# EAGLE design Fathom-Serial (EAGLE 7.4.0)

## Sheet 1 of 7
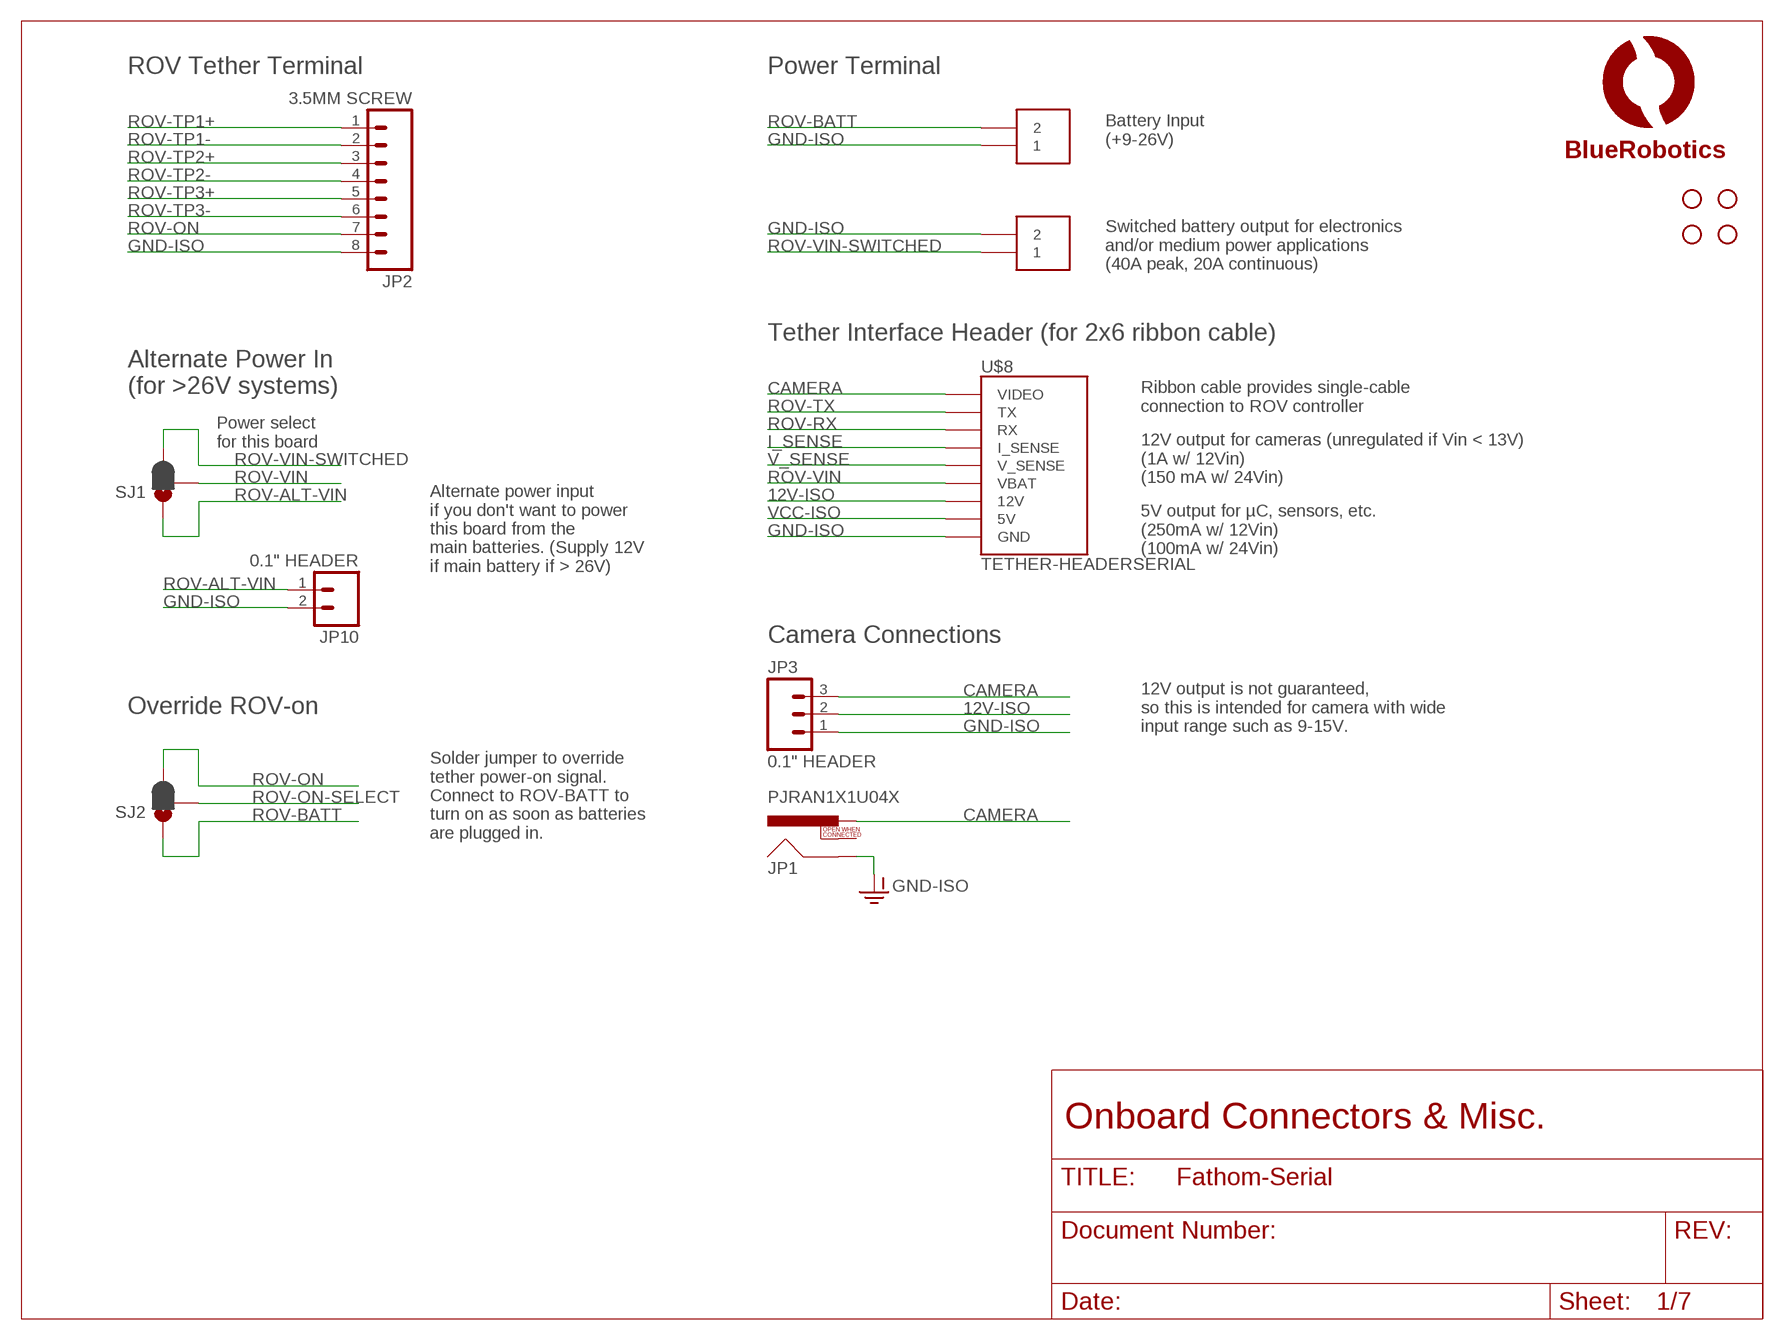
[diagram p0: schematic, sheet 1]

### Parts
JP1  PJRAN1X1U04X  RCA  [RCA]
JP2  3.5MM SCREW  M083.5MM-8  [SCREWTERMINAL-3.5MM-8]
JP3  0.1" HEADER  M03PTH  [1X03]
JP10  0.1" HEADER  M02PTH  [1X02]
SJ1  JUMPER-PAD-3-2OF3_NC_BY_PASTE  [PAD-JUMPER-3-2OF3_NC_BY_PASTE_YES_SILK_FULL_BOX]
SJ2  JUMPER-PAD-3-2OF3_NC_BY_PASTE  [PAD-JUMPER-3-2OF3_NC_BY_PASTE_YES_SILK_FULL_BOX]
STANDOFF1  STAND-OFF  [STAND-OFF]
STANDOFF2  STAND-OFF  [STAND-OFF]
STANDOFF3  STAND-OFF  [STAND-OFF]
STANDOFF4  STAND-OFF  [STAND-OFF]
U$4  LOGOFULL-M  [BR-FULL-LOGO-MEDIUM]
U$8  TETHER-HEADERSERIAL  [TETHER-HEADER-2X7]
U$10  HEADER-2  [TETHER-POWER-TERMINALS]
U$11  HEADER-2  [TETHER-POWER-TERMINALS]

### Nets
12V-ISO: JP3.2 U$8.12V ; also sheet 4
CAMERA: JP1.PIN JP3.3 U$8.VIDEO ; also sheet 6
GND-ISO: JP1.SHELL JP2.8 JP3.1 JP10.2 U$8.GND0(GND) U$8.GND1(GND) U$8.GND2(GND) U$10.1A U$10.1B U$11.2A U$11.2B ; also sheet 3,4,5,6,7
I_SENSE: U$8.I_SENSE ; also sheet 5
ROV-ALT-VIN: JP10.1 SJ1.1
ROV-BATT: SJ2.1 U$10.2A U$10.2B ; also sheet 5
ROV-ON: JP2.7 SJ2.3
ROV-ON-SELECT: SJ2.2 ; also sheet 5
ROV-RX: U$8.RX ; also sheet 7
ROV-TP1+: JP2.1 ; also sheet 6
ROV-TP1-: JP2.2 ; also sheet 6
ROV-TP2+: JP2.3 ; also sheet 7
ROV-TP2-: JP2.4 ; also sheet 7
ROV-TP3+: JP2.5 ; also sheet 7
ROV-TP3-: JP2.6 ; also sheet 7
ROV-TX: U$8.TX ; also sheet 7
ROV-VIN: SJ1.2 U$8.VBAT ; also sheet 4
ROV-VIN-SWITCHED: SJ1.3 U$11.1A U$11.1B ; also sheet 5
V_SENSE: U$8.V_SENSE ; also sheet 5
VCC-ISO: U$8.5V ; also sheet 3,4,5,6,7
Unconnected: JP1.SWITCH

### Notes on the sheet
- ROV Tether Terminal | Power Terminal
- Battery Input
  (+9-26V)
- Switched battery output for electronics 
  and/or medium power applications
  (40A peak, 20A continuous)
- Tether Interface Header (for 2x6 ribbon cable)
- Alternate Power In
  (for >26V systems)
- Ribbon cable provides single-cable 
  connection to ROV controller
- Power select 
  for this board
- 12V output for cameras (unregulated if Vin < 13V)
  (1A w/ 12Vin)
  (150 mA w/ 24Vin)
- 5V output for µC, sensors, etc.
  (250mA w/ 12Vin)
  (100mA w/ 24Vin)
- Alternate power input
  if you don't want to power
  this board from the 
  main batteries. (Supply 12V
  if main battery if > 26V)
- Camera Connections
- Override ROV-on
- 12V output is not guaranteed, 
  so this is intended for camera with wide 
  input range such as 9-15V.
- Solder jumper to override
  tether power-on signal. 
  Connect to ROV-BATT to 
  turn on as soon as batteries
  are plugged in.
- Onboard Connectors & Misc.

## Sheet 2 of 7
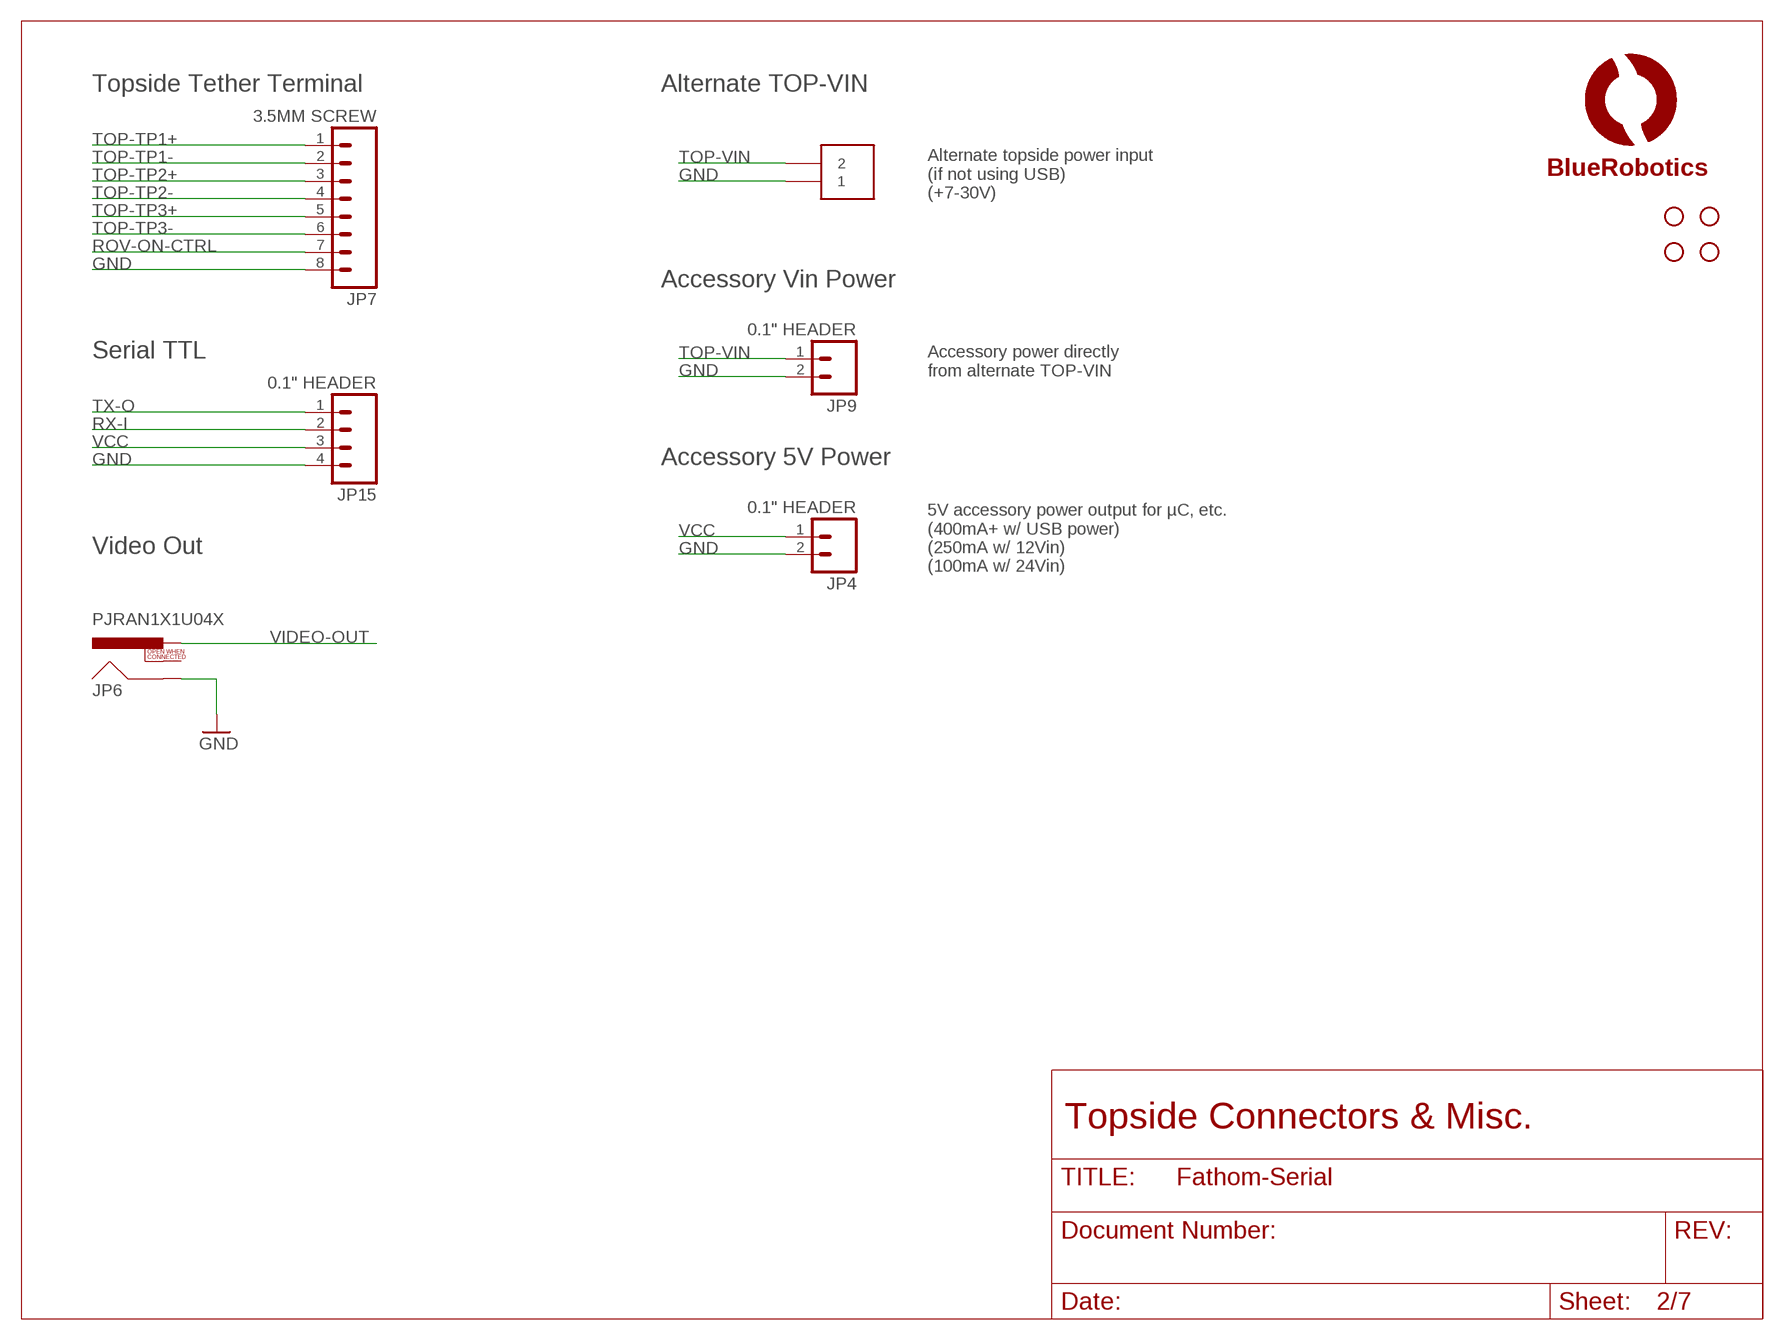
[diagram p1: schematic, sheet 2]

### Parts
JP4  0.1" HEADER  M02PTH  [1X02]
JP6  PJRAN1X1U04X  RCA  [RCA]
JP7  3.5MM SCREW  M083.5MM-8  [SCREWTERMINAL-3.5MM-8]
JP9  0.1" HEADER  M02PTH  [1X02]
JP15  0.1" HEADER  M04PTH  [1X04]
STANDOFF5  STAND-OFF  [STAND-OFF]
STANDOFF6  STAND-OFF  [STAND-OFF]
STANDOFF7  STAND-OFF  [STAND-OFF]
STANDOFF8  STAND-OFF  [STAND-OFF]
U$5  LOGOBR-LOGO-MS  [BR-LOGO-MEDIUM-SMALL]
U$12  HEADER-2  [TETHER-POWER-TERMINALS]

### Nets
GND: JP4.2 JP6.SHELL JP7.8 JP9.2 JP15.4 U$12.1A U$12.1B ; also sheet 3,4,6,7
ROV-ON-CTRL: JP7.7 ; also sheet 7
RX-I: JP15.2 ; also sheet 7
TOP-TP1+: JP7.1 ; also sheet 6
TOP-TP1-: JP7.2 ; also sheet 6
TOP-TP2+: JP7.3 ; also sheet 7
TOP-TP2-: JP7.4 ; also sheet 7
TOP-TP3+: JP7.5 ; also sheet 7
TOP-TP3-: JP7.6 ; also sheet 7
TOP-VIN: JP9.1 U$12.2A U$12.2B ; also sheet 4
TX-O: JP15.1 ; also sheet 7
VCC: JP4.1 JP15.3 ; also sheet 3,4,6,7
VIDEO-OUT: JP6.PIN ; also sheet 6
Unconnected: JP6.SWITCH

### Notes on the sheet
- Topside Tether Terminal | Alternate TOP-VIN
- Alternate topside power input 
  (if not using USB)
  (+7-30V)
- Accessory Vin Power
- Serial TTL
- Accessory power directly 
  from alternate TOP-VIN
- Accessory 5V Power
- Video Out
- 5V accessory power output for µC, etc.
  (400mA+ w/ USB power)
  (250mA w/ 12Vin)
  (100mA w/ 24Vin)
- Topside Connectors & Misc.

## Sheet 3 of 7
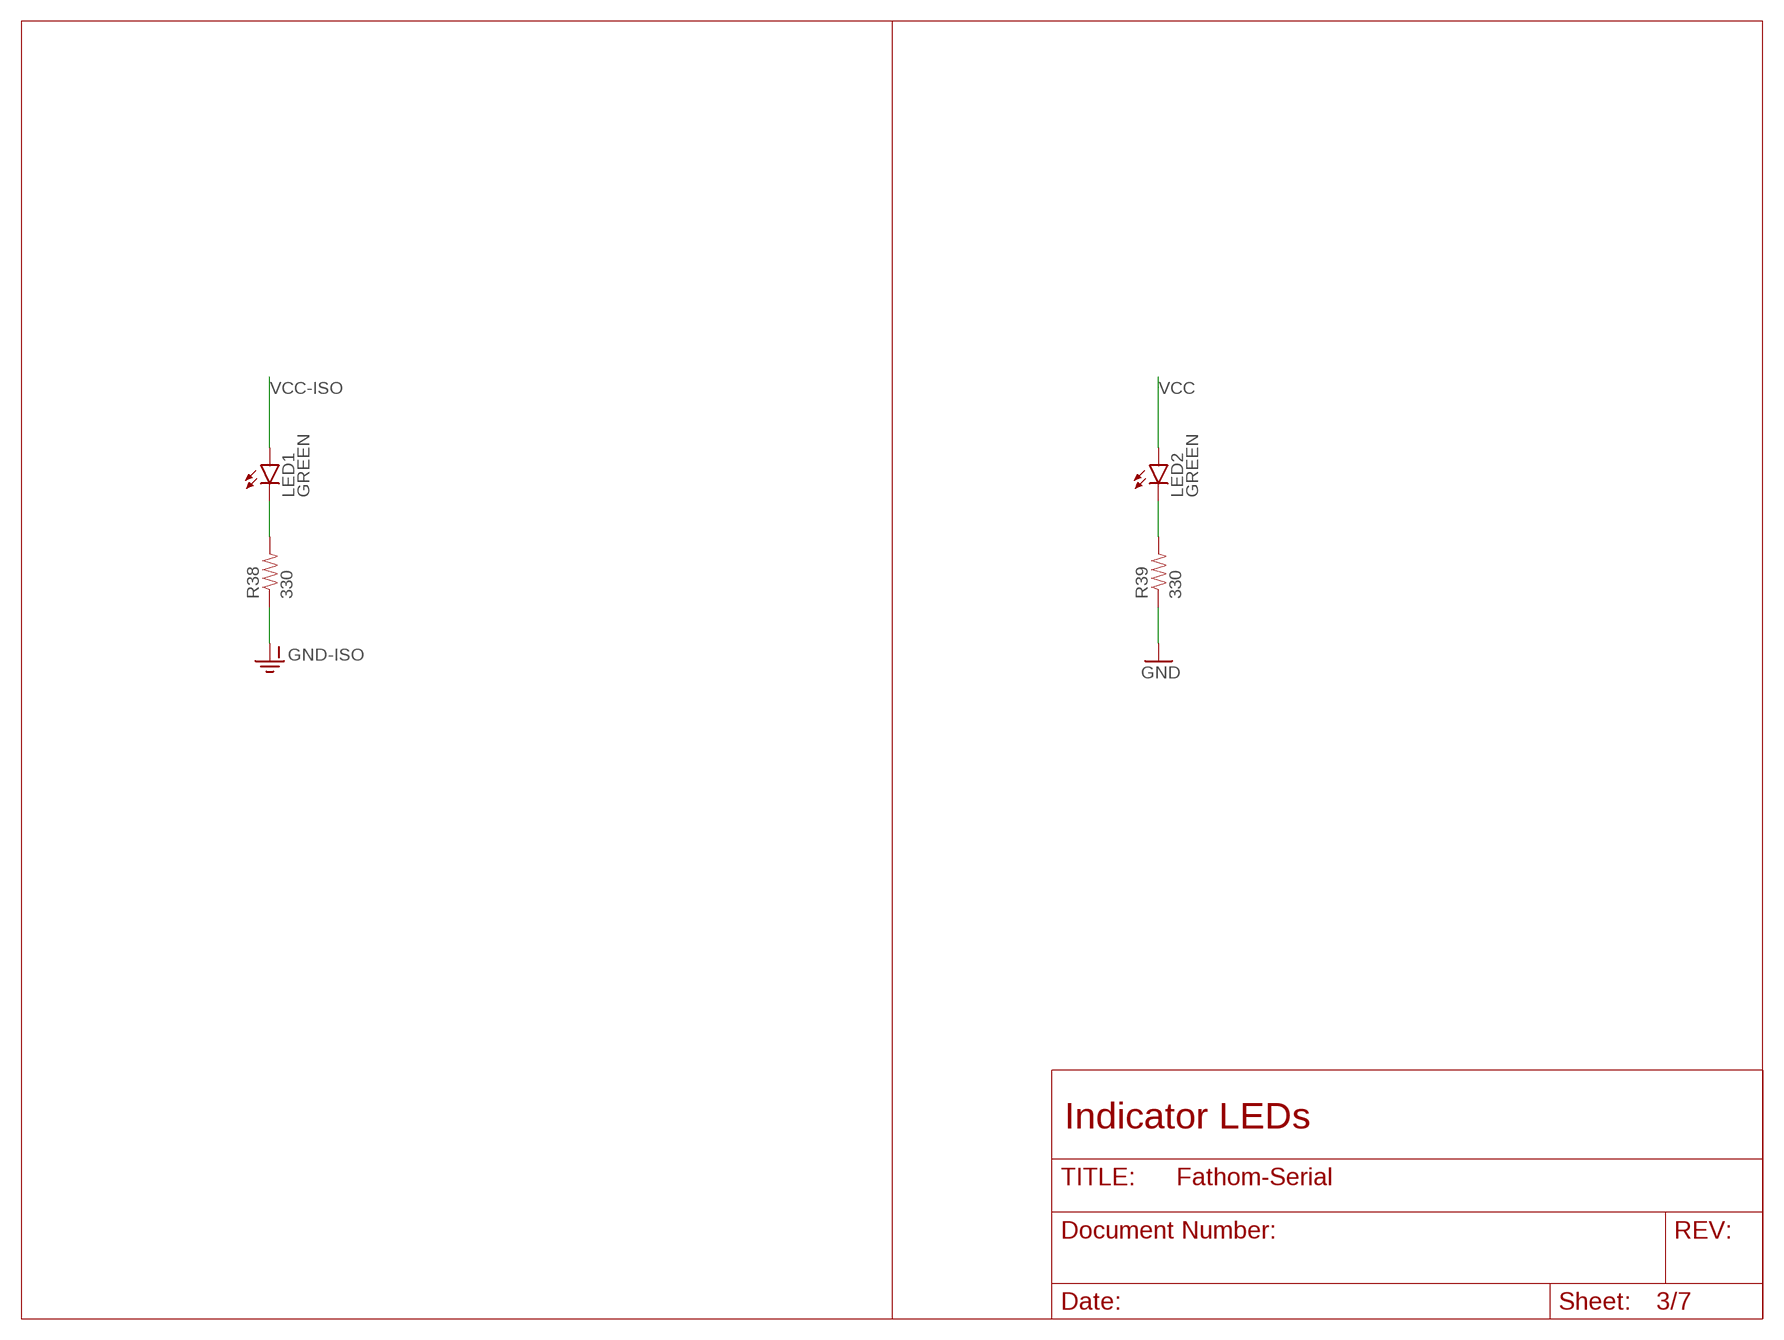
[diagram p2: schematic, sheet 3]

### Parts
LED1  GREEN  LED0603  [LED-0603]
LED2  GREEN  LED0603  [LED-0603]
R38  330  33KOHM1/10W1%(0603)  [0603-RES]
R39  330  33KOHM1/10W1%(0603)  [0603-RES]

### Nets
GND: R39.1 ; also sheet 2,4,6,7
GND-ISO: R38.1 ; also sheet 1,4,5,6,7
N$31: LED1.C R38.2
N$32: LED2.C R39.2
VCC: LED2.A ; also sheet 2,4,6,7
VCC-ISO: LED1.A ; also sheet 1,4,5,6,7

### Notes on the sheet
- Indicator LEDs

## Sheet 4 of 7
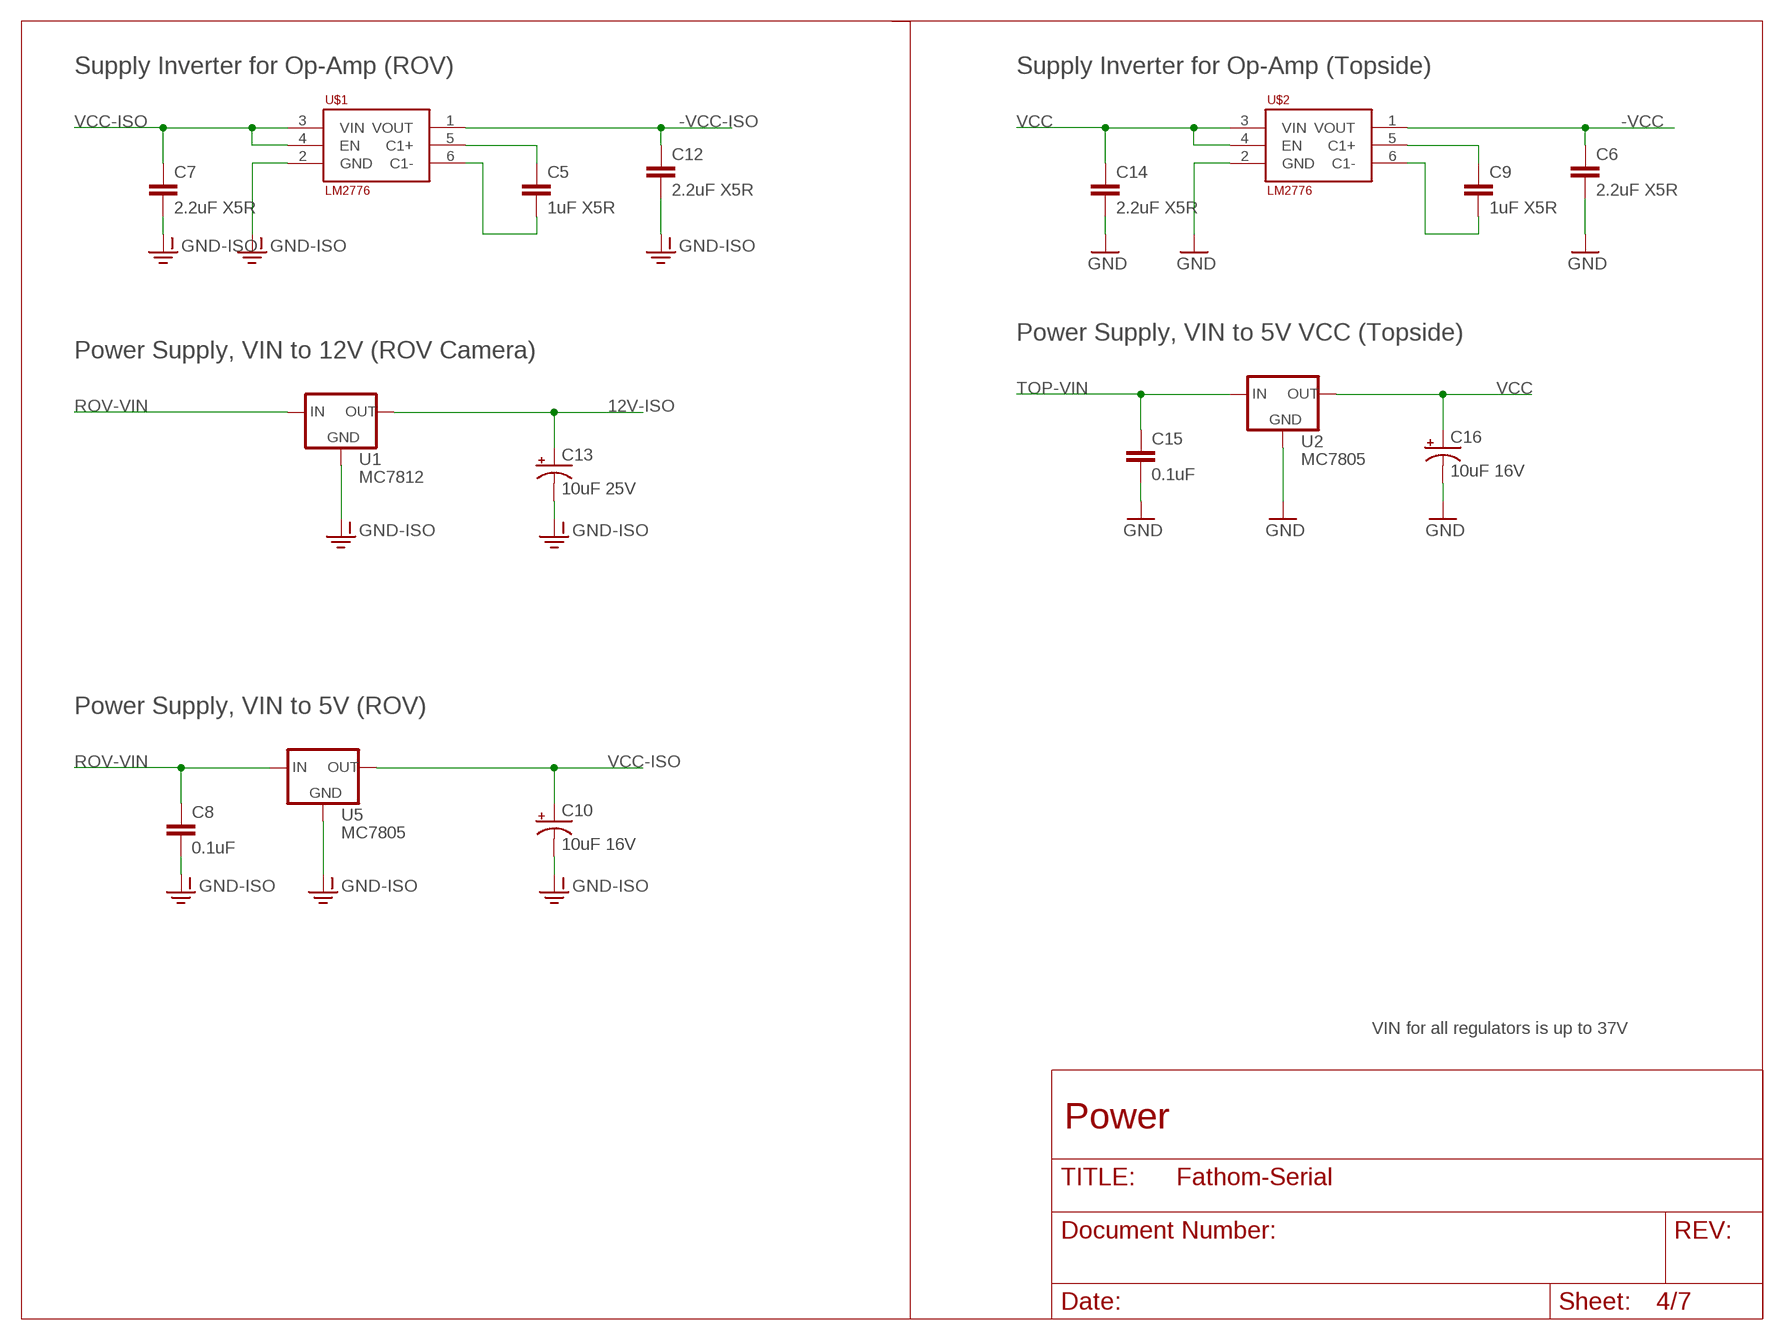
[diagram p3: schematic, sheet 4]

### Parts
C5  1uF X5R  CAP0603-CAP  [0603-CAP]
C6  2.2uF X5R  CAP0603-CAP  [0603-CAP]
C7  2.2uF X5R  CAP0603-CAP  [0603-CAP]
C8  0.1uF  CAP0603-CAP  [0603-CAP]
C9  1uF X5R  CAP0603-CAP  [0603-CAP]
C10  10uF 16V  CAP_POL1206  [EIA3216]
C12  2.2uF X5R  CAP0603-CAP  [0603-CAP]
C13  10uF 25V  CAP_POL6032  [EIA6032]
C14  2.2uF X5R  CAP0603-CAP  [0603-CAP]
C15  0.1uF  CAP0603-CAP  [0603-CAP]
C16  10uF 16V  CAP_POL1206  [EIA3216]
U1  MC7812  78XX  [DPAK]
U2  MC7805  78XX  [DPAK]
U5  MC7805  78XX  [DPAK]
U$1  LM2776  [SOT-23-6]
U$2  LM2776  [SOT-23-6]

### Nets
12V-ISO: C13.P$1(+) U1.3(OUT) ; also sheet 1
-VCC: C6.1 U$2.1(VOUT) ; also sheet 6
-VCC-ISO: C12.1 U$1.1(VOUT) ; also sheet 6
GND: C6.2 C14.2 C15.2 C16.C(-) U2.4(GND) U$2.2(GND) ; also sheet 2,3,6,7
GND-ISO: C7.2 C8.2 C10.C(-) C12.2 C13.P$2(-) U1.4(GND) U5.4(GND) U$1.2(GND) ; also sheet 1,3,5,6,7
N$3: C9.1 U$2.5(C1+)
N$4: C9.2 U$2.6(C1-)
N$10: C5.1 U$1.5(C1+)
N$11: C5.2 U$1.6(C1-)
ROV-VIN: C8.1 U1.1(IN) U5.1(IN) ; also sheet 1
TOP-VIN: C15.1 U2.1(IN) ; also sheet 2
VCC: C14.1 C16.A(+) U2.3(OUT) U$2.3(VIN) U$2.4(EN) ; also sheet 2,3,6,7
VCC-ISO: C7.1 C10.A(+) U5.3(OUT) U$1.3(VIN) U$1.4(EN) ; also sheet 1,3,5,6,7

### Notes on the sheet
- Supply Inverter for Op-Amp (ROV) | Supply Inverter for Op-Amp (Topside)
- Power Supply, VIN to 5V VCC (Topside)
- Power Supply, VIN to 12V (ROV Camera)
- Power Supply, VIN to 5V (ROV)
- VIN for all regulators is up to 37V
- Power

## Sheet 5 of 7
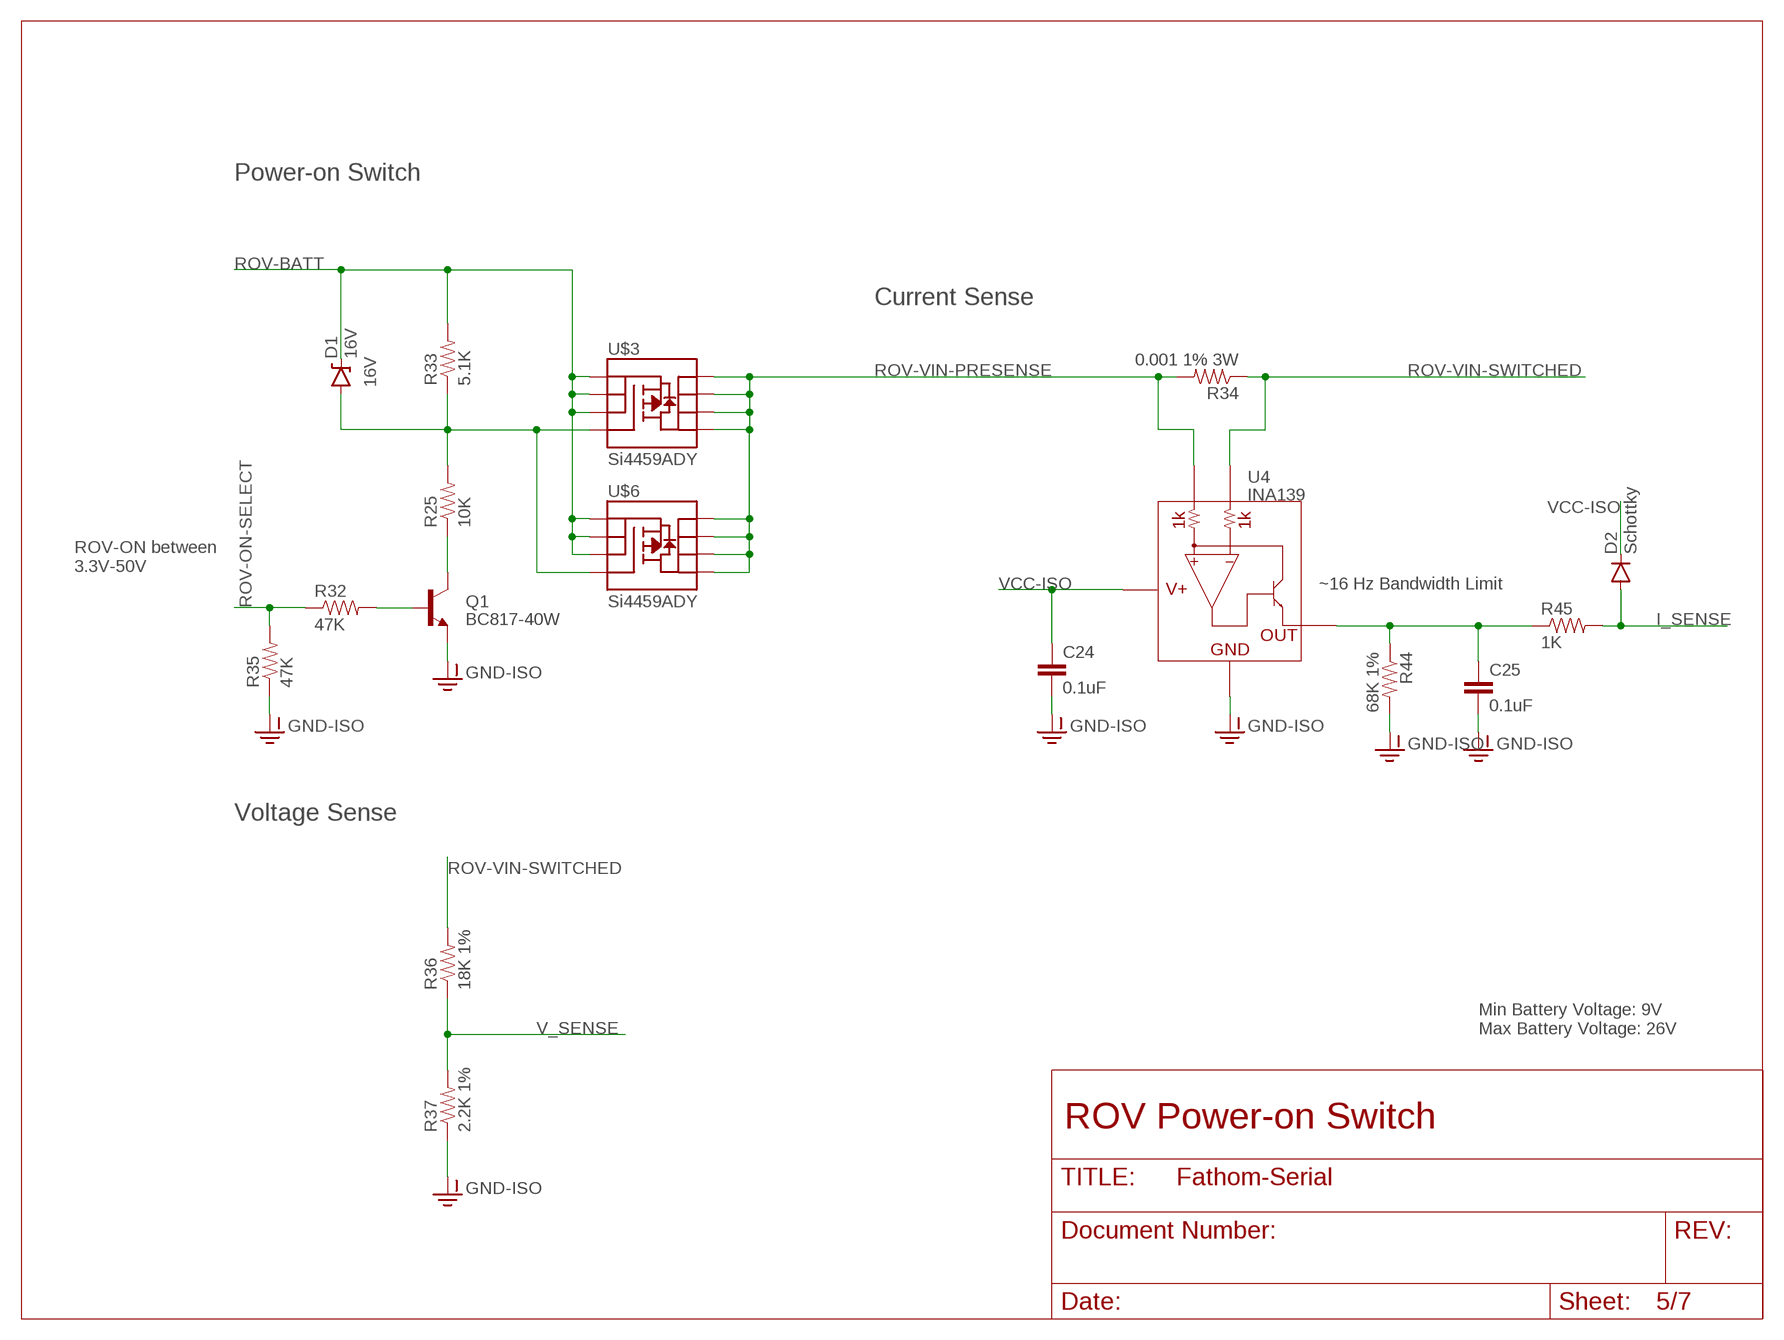
[diagram p4: schematic, sheet 5]

### Parts
C24  0.1uF  CAP0603-CAP  [0603-CAP]
C25  0.1uF  CAP0603-CAP  [0603-CAP]
D1  16V  DIODE-ZENER3.3V  [SOD-323]
D2  Schottky  DIODESOD  [SOD-323]
Q1  BC817-40W  TRANSISTOR_NPNSOT23  [SOT23]
R25  10K  33KOHM1/10W1%(0603)  [0603-RES]
R32  47K  33KOHM1/10W1%(0603)  [0603-RES]
R33  5.1K  33KOHM1/10W1%(0603)  [0603-RES]
R34  0.001 1% 3W  RESISTOR2512  [R2512]
R35  47K  33KOHM1/10W1%(0603)  [0603-RES]
R36  18K 1%  33KOHM1/10W1%(0603)  [0603-RES]
R37  2.2K 1%  33KOHM1/10W1%(0603)  [0603-RES]
R44  68K 1%  33KOHM1/10W1%(0603)  [0603-RES]
R45  1K  33KOHM1/10W1%(0603)  [0603-RES]
U4  INA139  [SOT23-5]
U$3  Si4459ADY  MOSFET-PCHANNEL-SOIC8SOIC8  [SO08]
U$6  Si4459ADY  MOSFET-PCHANNEL-SOIC8SOIC8  [SO08]

### Nets
GND-ISO: C24.2 C25.2 Q1.2(E) R35.1 R37.1 R44.2 U4.2(GND) ; also sheet 1,3,4,6,7
I_SENSE: D2.A R45.2 ; also sheet 1
N$27: Q1.1(B) R32.2
N$28: D1.A R25.2 R33.1 U$3.4(G) U$6.4(G)
N$30: Q1.3(C) R25.1
N$33: C25.1 R44.1 R45.1 U4.1(OUT)
ROV-BATT: D1.C R33.2 U$3.1(S) U$3.2(S) U$3.3(S) U$6.1(S) U$6.2(S) U$6.3(S) ; also sheet 1
ROV-ON-SELECT: R32.1 R35.2 ; also sheet 1
ROV-VIN-PRESENSE: R34.2 U4.3(VIN+) U$3.5(D) U$3.6(D) U$3.7(D) U$3.8(D) U$6.5(D) U$6.6(D) U$6.7(D) U$6.8(D)
ROV-VIN-SWITCHED: R34.1 R36.2 U4.4(VIN-) ; also sheet 1
V_SENSE: R36.1 R37.2 ; also sheet 1
VCC-ISO: C24.1 D2.C U4.5(V+) ; also sheet 1,3,4,6,7

### Notes on the sheet
- Power-on Switch
- Current Sense
- 16V
- ROV-ON between
  3.3V-50V
- ~16 Hz Bandwidth Limit
- Voltage Sense
- Min Battery Voltage: 9V
  Max Battery Voltage: 26V
- ROV Power-on Switch

## Sheet 6 of 7
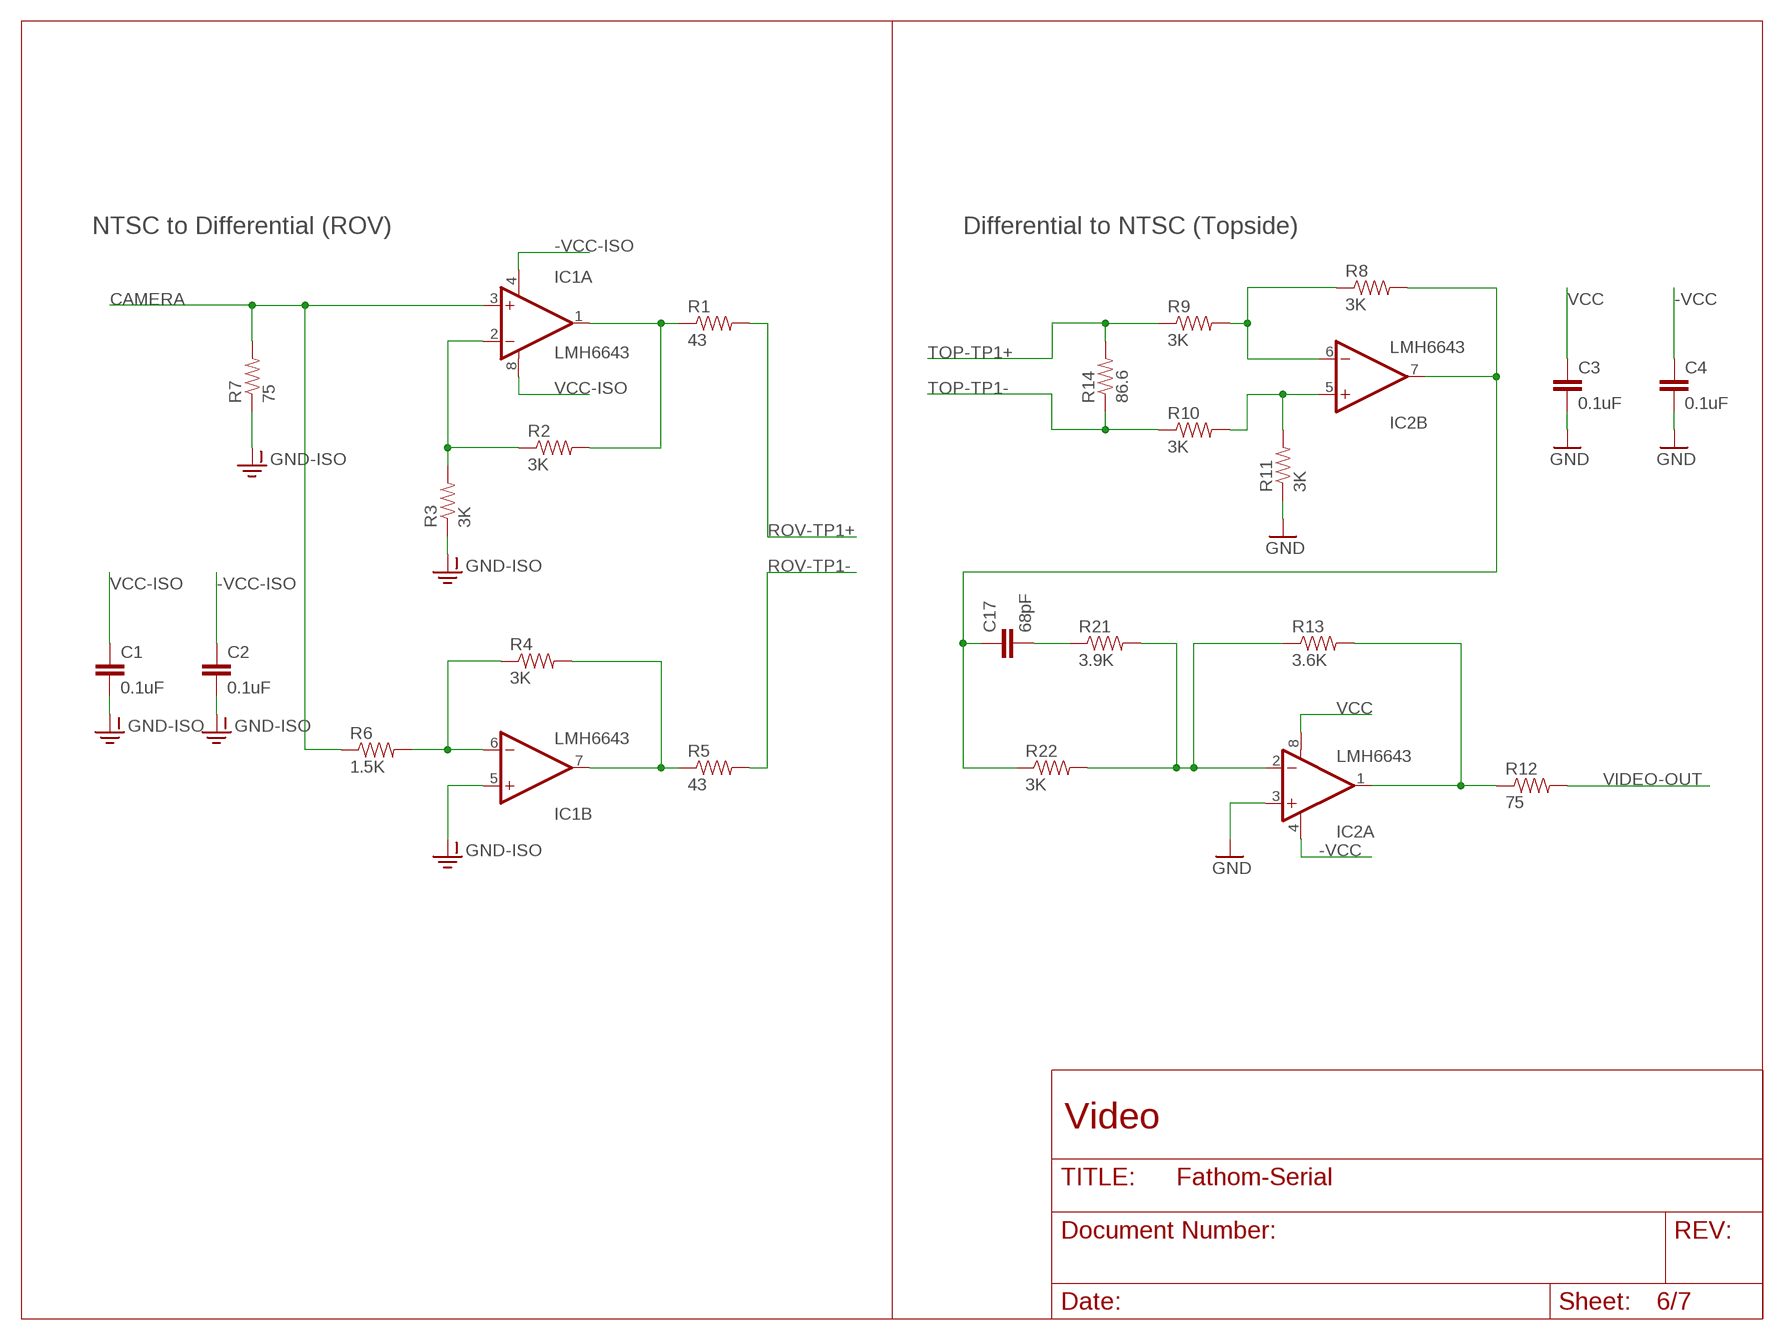
[diagram p5: schematic, sheet 6]

### Parts
C1  0.1uF  CAP0603-CAP  [0603-CAP]
C2  0.1uF  CAP0603-CAP  [0603-CAP]
C3  0.1uF  CAP0603-CAP  [0603-CAP]
C4  0.1uF  CAP0603-CAP  [0603-CAP]
C17  68pF  CAP0603-CAP  [0603-CAP]
IC1  LMH6643  OPAMP-DUALU  [SO08]
IC2  LMH6643  OPAMP-DUALU  [SO08]
R1  43  RESISTOR0603-RES  [0603-RES]
R2  3K  RESISTOR0603-RES  [0603-RES]
R3  3K  RESISTOR0603-RES  [0603-RES]
R4  3K  RESISTOR0603-RES  [0603-RES]
R5  43  RESISTOR0603-RES  [0603-RES]
R6  1.5K  RESISTOR0603-RES  [0603-RES]
R7  75  RESISTOR0603-RES  [0603-RES]
R8  3K  RESISTOR0603-RES  [0603-RES]
R9  3K  RESISTOR0603-RES  [0603-RES]
R10  3K  RESISTOR0603-RES  [0603-RES]
R11  3K  RESISTOR0603-RES  [0603-RES]
R12  75  RESISTOR0603-RES  [0603-RES]
R13  3.6K  RESISTOR0603-RES  [0603-RES]
R14  86.6  RESISTOR0603-RES  [0603-RES]
R21  3.9K  RESISTOR0603-RES  [0603-RES]
R22  3K  RESISTOR0603-RES  [0603-RES]

### Nets
-VCC: C4.1 IC2.4(A:V-) ; also sheet 4
-VCC-ISO: C2.1 IC1.4(A:V-) ; also sheet 4
CAMERA: IC1.3(A:+IN) R6.1 R7.2 ; also sheet 1
GND: C3.2 C4.2 IC2.3(A:+IN) R11.1 ; also sheet 2,3,4,7
GND-ISO: C1.2 C2.2 IC1.5(B:+IN) R3.1 R7.1 ; also sheet 1,3,4,5,7
N$1: IC1.1(A:OUT) R1.1 R2.2
N$2: IC1.7(B:OUT) R4.2 R5.1
N$5: IC1.2(A:-IN) R2.1 R3.2
N$6: IC1.6(B:-IN) R4.1 R6.2
N$8: IC2.5(B:+IN) R10.2 R11.2
N$9: IC2.6(B:-IN) R8.1 R9.2
N$14: C17.1 IC2.7(B:OUT) R8.2 R22.1
N$15: IC2.2(A:-IN) R13.1 R21.2 R22.2
N$16: C17.2 R21.1
N$17: IC2.1(A:OUT) R12.1 R13.2
ROV-TP1+: R1.2 ; also sheet 1
ROV-TP1-: R5.2 ; also sheet 1
TOP-TP1+: R9.1 R14.2 ; also sheet 2
TOP-TP1-: R10.1 R14.1 ; also sheet 2
VCC: C3.1 IC2.8(A:V+) ; also sheet 2,3,4,7
VCC-ISO: C1.1 IC1.8(A:V+) ; also sheet 1,3,4,5,7
VIDEO-OUT: R12.2 ; also sheet 2

### Notes on the sheet
- NTSC to Differential (ROV) | Differential to NTSC (Topside)
- Video

## Sheet 7 of 7
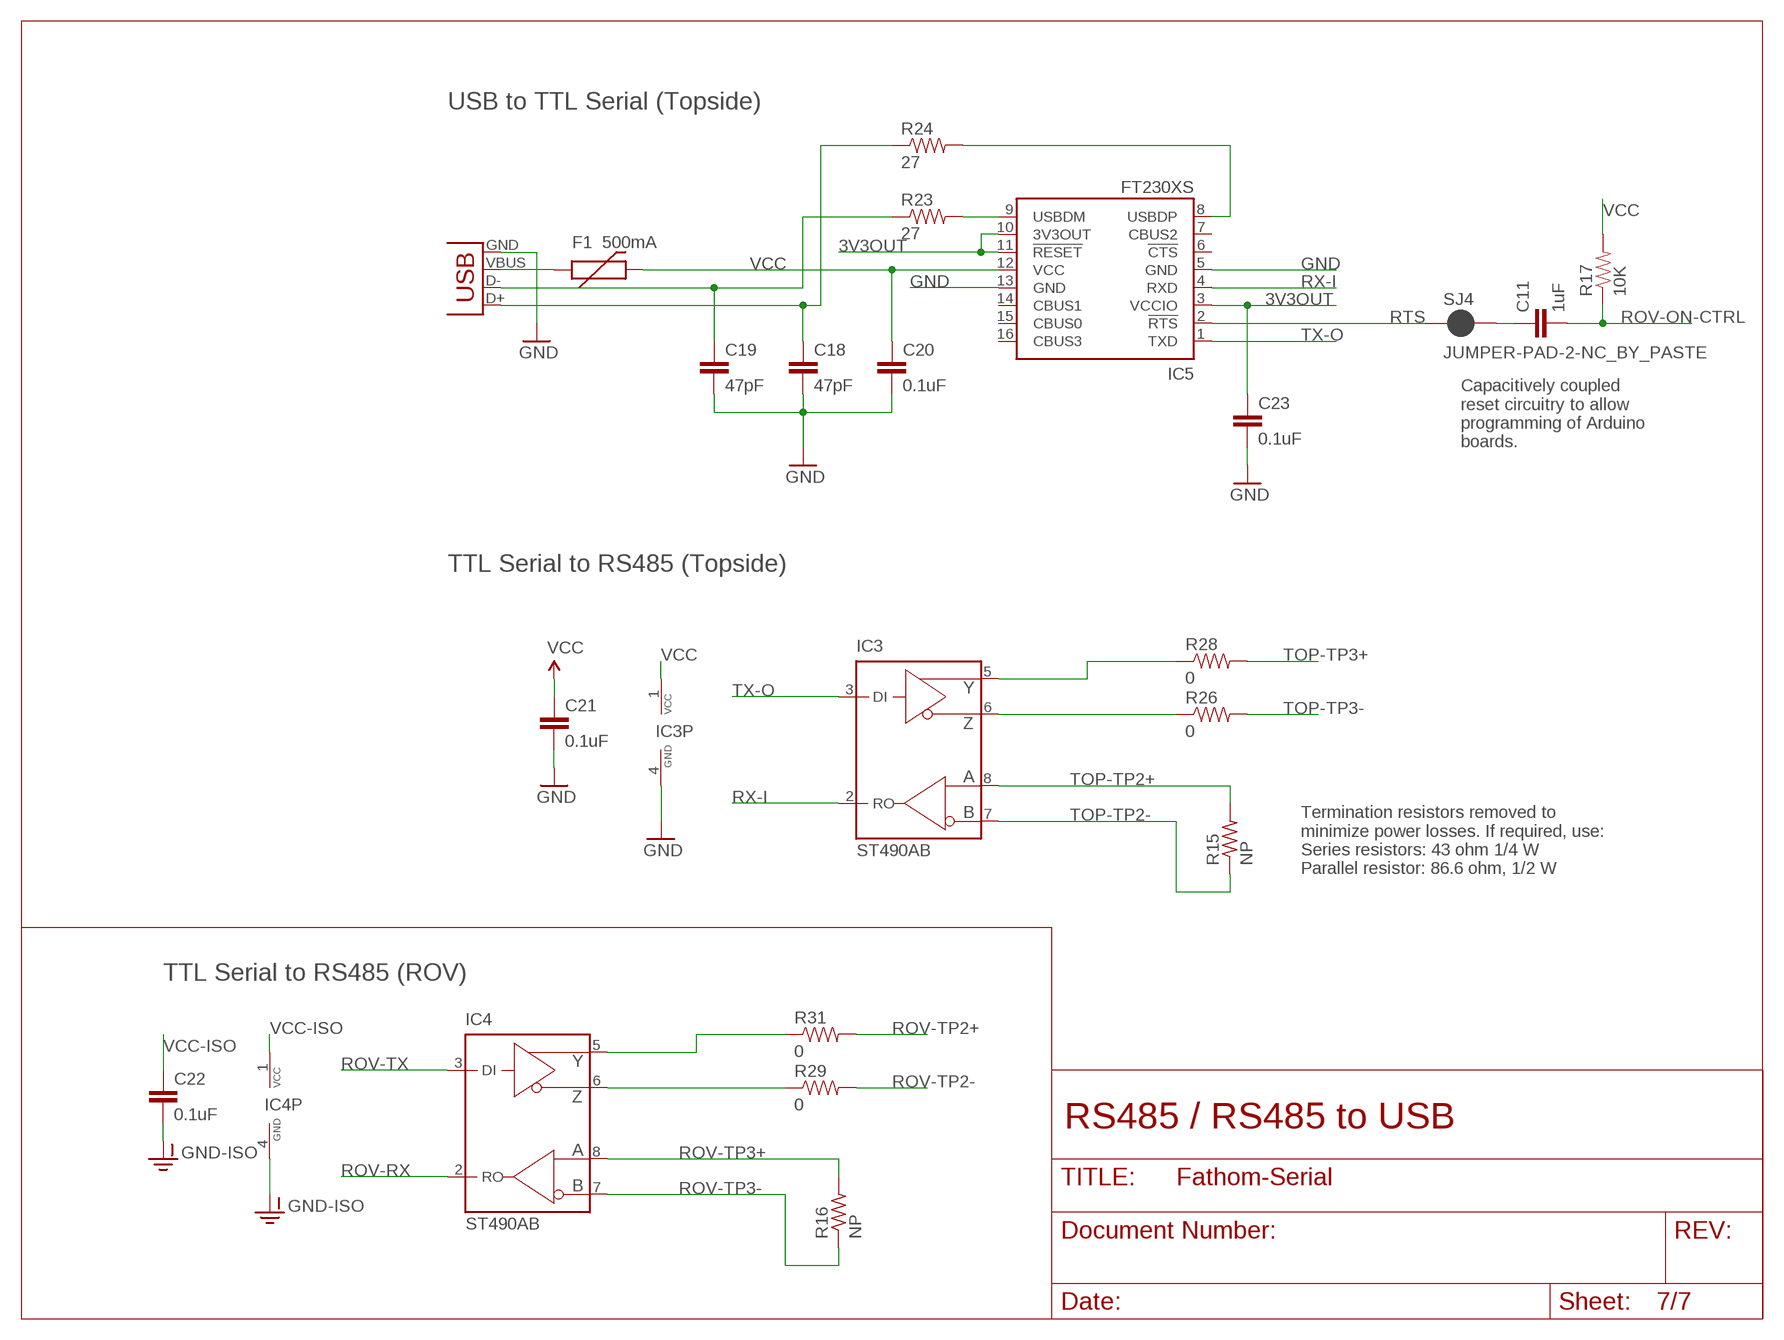
[diagram p6: schematic, sheet 7]

### Parts
C11  1uF  CAP0603-CAP  [0603-CAP]
C18  47pF  CAP0603-CAP  [0603-CAP]
C19  47pF  CAP0603-CAP  [0603-CAP]
C20  0.1uF  CAP0603-CAP  [0603-CAP]
C21  0.1uF  CAP0603-CAP  [0603-CAP]
C22  0.1uF  CAP0603-CAP  [0603-CAP]
C23  0.1uF  CAP0603-CAP  [0603-CAP]
F1  500mA  PTC0603  [0603]
IC3  ST490AB  MAX488CSA  [SO08]
IC4  ST490AB  MAX488CSA  [SO08]
IC5  FT230XS  [SSOP16]
R15  NP  R-US_R1210  [R1210]
R16  NP  R-US_R1210  [R1210]
R17  10K  RESISTOR0603-RES  [0603-RES]
R23  27  RESISTOR0603-RES  [0603-RES]
R24  27  RESISTOR0603-RES  [0603-RES]
R26  0  RESISTOR1206  [1206]
R28  0  RESISTOR1206  [1206]
R29  0  RESISTOR1206  [1206]
R31  0  RESISTOR1206  [1206]
SJ4  JUMPER-PAD-2-NC_BY_PASTE  [PAD-JUMPER-2-NC_BY_PASTE_YES_SILK]
X2  USBSMD  [USB-MINIB]

### Nets
3V3OUT: C23.1 IC5.3(VCCIO) IC5.10(3V3OUT) IC5.11(!RESET)
GND: C18.2 C19.2 C20.2 C21.2 C23.2 IC3.4(GND) IC5.5(GND) IC5.13(GND) X2.GND ; also sheet 2,3,4,6
GND-ISO: C22.2 IC4.4(GND) ; also sheet 1,3,4,5,6
N$7: C11.1 SJ4.2
N$19: C19.1 R23.1 X2.D-
N$20: C18.1 R24.1 X2.D+
N$21: F1.1 X2.VBUS
N$22: IC5.8(USBDP) R24.2
N$23: IC3.5(Y) R28.1
N$24: IC4.5(Y) R31.1
N$25: IC4.6(Z) R29.1
N$26: IC3.6(Z) R26.1
N$29: IC5.9(USBDM) R23.2
ROV-ON-CTRL: C11.2 R17.1 ; also sheet 2
ROV-RX: IC4.2(RO) ; also sheet 1
ROV-TP2+: R31.2 ; also sheet 1
ROV-TP2-: R29.2 ; also sheet 1
ROV-TP3+: IC4.8(A) R16.2 ; also sheet 1
ROV-TP3-: IC4.7(B) R16.1 ; also sheet 1
ROV-TX: IC4.3(DI) ; also sheet 1
RTS: IC5.2(!RTS) SJ4.1
RX-I: IC3.2(RO) IC5.4(RXD) ; also sheet 2
TOP-TP2+: IC3.8(A) R15.2 ; also sheet 2
TOP-TP2-: IC3.7(B) R15.1 ; also sheet 2
TOP-TP3+: R28.2 ; also sheet 2
TOP-TP3-: R26.2 ; also sheet 2
TX-O: IC3.3(DI) IC5.1(TXD) ; also sheet 2
VCC: C20.1 C21.1 F1.2 IC3.1(VCC) IC5.12(VCC) R17.2 ; also sheet 2,3,4,6
VCC-ISO: C22.1 IC4.1(VCC) ; also sheet 1,3,4,5,6
Unconnected: IC5.6(!CTS) IC5.7(CBUS2) IC5.14(CBUS1) IC5.15(CBUS0) IC5.16(CBUS3)

### Notes on the sheet
- USB to TTL Serial (Topside)
- Capacitively coupled
  reset circuitry to allow
  programming of Arduino
  boards.
- TTL Serial to RS485 (Topside)
- Termination resistors removed to 
  minimize power losses. If required, use:
  Series resistors: 43 ohm 1/4 W
  Parallel resistor: 86.6 ohm, 1/2 W
- TTL Serial to RS485 (ROV)
- RS485 / RS485 to USB

## Library data of the parts
C1-C9 C12 C14 C15 C17 C24 C25 = SparkFun-Passives:CAP: Capacitor Standard 0603 ceramic capacitor, and 0.1" leaded capacitor.
C10 C13 C16 = SparkFun-Passives:CAP_POL: Capacitor Polarized These are standard SMD and PTH capacitors. Normally 10uF, 47uF, and 100uF in electrolytic and tantalum varieties. Always verify the external diameter of the through hole cap, it varies with capacity, voltage, and manufacturer. The EIA devices should be standard.
C11 C18-C23 = SparkFun:CAP: Capacitor Standard 0603 ceramic capacitor, and 0.1" leaded capacitor.
D1 = SparkFun-DiscreteSemi:DIODE-ZENER: Zener Diode Production Part - 8199 3.4V Zener Voltage; PROD_ID: DIO-11284; VALUE: 3.3V
D2 = SparkFun-DiscreteSemi:DIODE: Diode These are standard reverse protection diodes and small signal diodes. SMA package can handle up to about 1A. SOD-323 can handle about 200mA. What the SOD-323 package when ordering, there are some mfgs out there that are 5-pin packages.; PROD_ID: DIO-09646
F1 = SparkFun:PTC: Resettable Fuse PTC Resettable Fuse. Spark Fun Electronics SKU : COM-08357
IC1 IC2 = SparkFun-AnalogIC:OPAMP-DUAL: Generic op-amp footprint
IC3 IC4 = maxim:MAX488: RS485 TRANSEIVER Source: Data sheet <http://datasheets.maxim-ic.com/en/ds/MAX1487-MAX491.pdf>; MF: MAXIM; MPN: MAX488CSA; OC_FARNELL: 3534170; OC_NEWARK: 34C3921
IC5 = ftdichip:FT230X: USB to BASIC UART IC Auto generated by make-symbol-device-package-bsdl.ulp Rev. 43 Source: Data sheet <http://www.ftdichip.com/Support/Documents/DataSheets/ICs/DS_FT230X.pdf>
JP1 JP6 = BR-Eagle-Library:RCA
JP2 JP7 = SparkFun-Connectors:M08: Header 8 Standard 8-pin 0.1" header. Use with straight break away headers (SKU : PRT-00116), right angle break away headers (PRT-00553), swiss pins (PRT-00743), machine pins (PRT-00117), and female headers (PRT-00115).
JP3 = SparkFun-Connectors:M03: Header 3 Standard 3-pin 0.1" header. Use with straight break away headers (SKU : PRT-00116), right angle break away headers (PRT-00553), swiss pins (PRT-00743), machine pins (PRT-00117), and female headers (PRT-00115). Molex polarized connector foot print use with SKU : PRT-08232 with associated crimp pins and housings.
JP4 JP9 JP10 = SparkFun-Connectors:M02: Standard 2-pin 0.1" header. Use with - straight break away headers ( PRT-00116) - right angle break away headers (PRT-00553) - swiss pins (PRT-00743) - machine pins (PRT-00117) - female headers (PRT-00115) Molex polarized connector foot print use with: PRT-08233 with associated crimp pins and housings. 2.54_SCREWTERM for use with PRT-10571. 3.5mm Screw Terminal footprints for PRT-08084 5mm Screw Terminal footprints for use with PRT-08433
JP15 = SparkFun-Connectors:M04: Header 4 Standard 4-pin 0.1" header. Use with straight break away headers (SKU : PRT-00116), right angle break away headers (PRT-00553), swiss pins (PRT-00743), machine pins (PRT-00117), and female headers (PRT-00115). Molex polarized connector foot print use with SKU : PRT-08231 with associated crimp pins and housings. 1MM SMD Version SKU: PRT-10208
LED1 LED2 = SparkFun-LED:LED: LEDs Standard schematic elements and footprints for 5mm, 3mm, 1206, and 0603 sized LEDs. 5mm - Spark Fun Electronics SKU : COM-00529 (and others)
Q1 = SparkFun-DiscreteSemi:TRANSISTOR_NPN: Generic NPN BJT MMBT2222A - TRANS-08049 (SOT-23, 1A 40V) MPSA42 - TRANS-09116 (SOT-23, 500mA 300V) MMBT5088LT1G - TRANS-11160 (SOT-23, 50 mA 30V) BC547 - COM-08928 <http://www.sparkfun.com/products/8928> (TO-92 45V 100mA) (1.Collector 2.Base 3.Emitter) 2N3904 - COM-00521 <http://www.sparkfun.com/products/521> (TO-92 40V 200mA) (1.Emitter 2.Base 3.Collector) P2N2222A - COM-12852 <http://www.sparkfun.com/products/12852> (TO-92 40V 600mA) (1.Collector 2.Base 3.Emitter)
R1-R14 R21 R22 = SparkFun-Passives:RESISTOR: Resistor
R15 R16 = resistor:R-US_: RESISTOR, American symbol
R17 R23 R24 R26 R28 R29 R31 = SparkFun:RESISTOR: Resistor
R25 R32 R33 R35-R39 R44 R45 = SparkFun-Resistors:33KOHM1/10W1%(0603): RES-08416
R34 = SparkFun-Resistors:RESISTOR: Resistor
SJ1 SJ2 = SparkFun-Passives:JUMPER-PAD-3-2OF3_NC_BY_PASTE
SJ4 = SparkFun-Passives:JUMPER-PAD-2-NC_BY_PASTE
STANDOFF1-STANDOFF8 = SparkFun-Electromechanical:STAND-OFF: #4 Stand Off This is the mechanical footprint for a #4 phillips button head screw. Use the keepout ring to avoid running the screw head into surrounding components. SKU : PRT-00447
U1 U2 U5 = BR-Eagle-Library:78XX
U4 = SparkFun-AnalogIC:INA139: High-side shunt current sense 2.7V-40V, 1%
U$1 U$2 = BR-Eagle-Library:LM2776
U$3 U$6 = SparkFun-DiscreteSemi:MOSFET-PCHANNEL-SOIC8: Generic 8-pin PMOSFET
U$4 U$5 = BR-Eagle-Library:LOGO
U$8 = BR-Eagle-Library:TETHER-HEADER
U$10-U$12 = BR-Eagle-Library:HEADER-2
X2 = SparkFun:USB: USB Connectors USB-B-PTH is fully proven SKU : PRT-00139 USB-miniB is fully proven SKU : PRT-00587 USB-A-PCB is untested. USB-A-H is throughly reviewed, but untested. Spark Fun Electronics SKU : PRT-00437 USB-B-SMT is throughly reviewed, but untested. Needs silkscreen touching up. USB-A-S has not been used/tested USB-MB-H has not been used/tested

## Net classes
1 power: width 0.254 mm

## Board
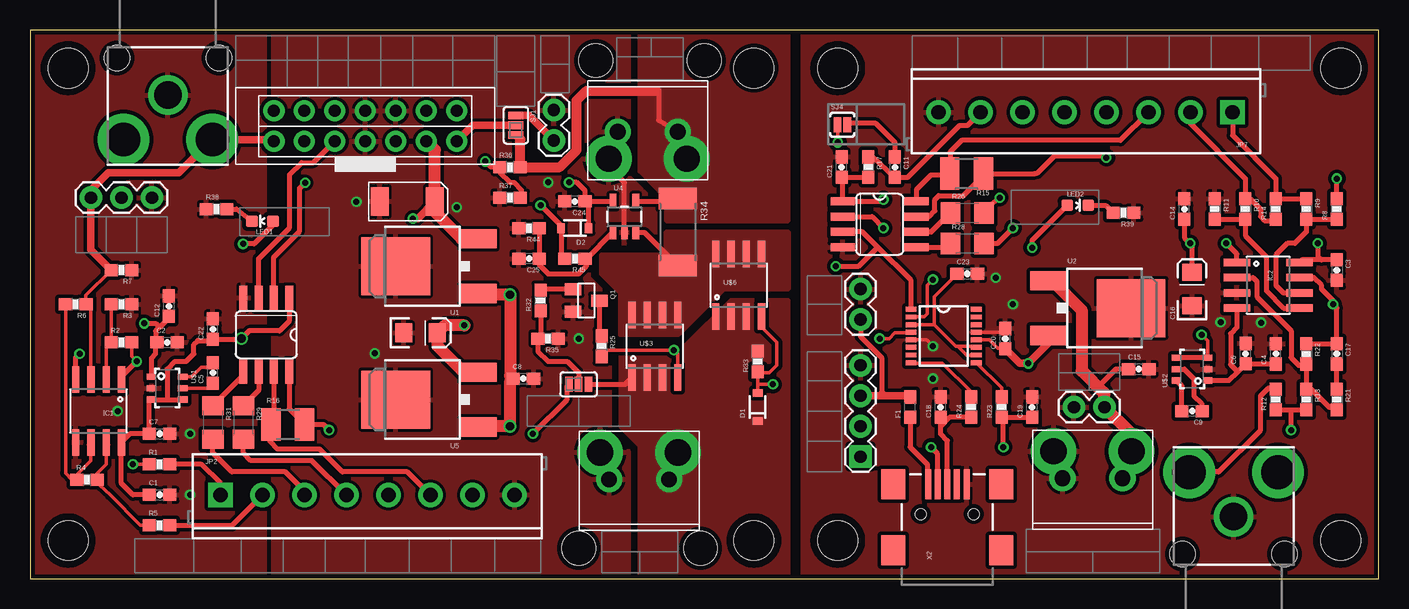
[diagram p7: board, top side]
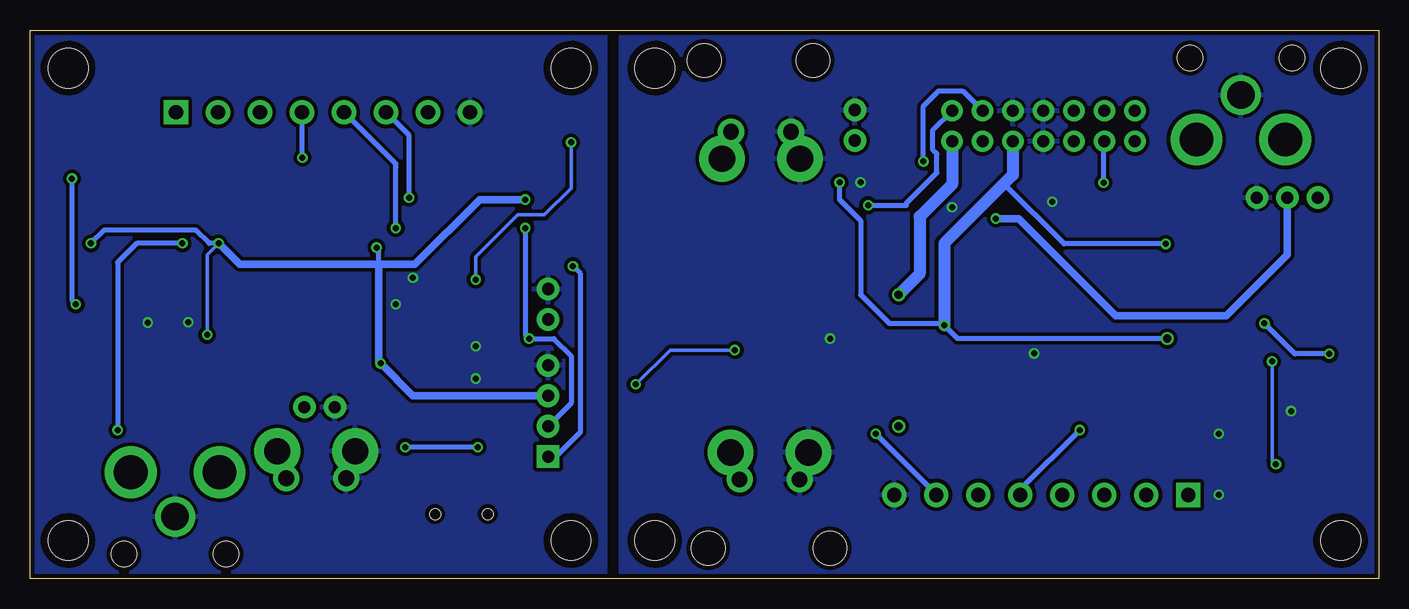
[diagram p8: board, bottom side, seen from below]

Size 112.39 x 45.72 mm. Coordinates in mm from the lower left corner, seen from the top.
Outline: 0,0 112.39,0 112.39,45.72 0,45.72 0,0
Copper layers (1*16): Top 0.0356mm / dielectric 1.5011mm / Bottom 0.0356mm
Design rules "OSH-Park": minimum track width 6mil, minimum drill 13mil, track to track 6mil, track to pad 6mil, pad to pad 6mil, via to via 6mil, smd to smd 6mil, copper to edge 15mil, drill to drill 6mil, minimum pad ring 7mil, minimum via ring 7mil, stop-mask expansion 3mil, vias tented up to drill 0mil, thermal gap 10mil
Holes 2.8 mm at 47.15,43.18 56.2,43.18 45.72,2.54 55.88,2.54

### Footprints (pad centres in the part's own frame; a part is rotated, then mirrored left to right if it is on the bottom)
0603-CAP = smd 1.1 x 1: 1 -0.85,0; 2 0.85,0
EIA3216 = smd 1.4 x 1.6: A 1.4,0; C -1.4,0
EIA6032 = smd 1.5 x 2.4: P$1 -2.3,0; P$2 2.3,0
SOD-323 = smd 0.63 x 0.83: A 1.15,0; C -1.15,0
0603 = smd 1.1 x 1: 1 -0.85,0; 2 0.85,0
SO08 = smd 0.61 x 2.21: 1 -1.905,-2.616; 2 -0.635,-2.616; 3 0.635,-2.616; 4 1.905,-2.616; 5 1.905,2.616; 6 0.635,2.616; 7 -0.635,2.616; 8 -1.905,2.616
SO08' = smd 0.66 x 2.032: 1 -1.905,-3.073; 2 -0.635,-3.073; 3 0.635,-3.073; 4 1.905,-3.073; 5 1.905,3.073; 6 0.635,3.073; 7 -0.635,3.073; 8 -1.905,3.073
SSOP16 = smd 0.914 x 0.406: 1 -2.718,2.223; 2 -2.718,1.587; 3 -2.718,0.953; 4 -2.718,0.318; 5 -2.718,-0.318; 6 -2.718,-0.953; 7 -2.718,-1.587; 8 -2.718,-2.223; 9 2.718,-2.223; 10 2.718,-1.587; 11 2.718,-0.953; 12 2.718,-0.318; 13 2.718,0.318; 14 2.718,0.953; 15 2.718,1.587; 16 2.718,2.223
RCA = drill 2.8 pad 4.318: PIN 3.7,3.7; SWITCH 3.7,-3.7 | drill 2.3: SHELL 0,0 | hole 2.1: -3.1,4.25; -3.1,-4.25
SCREWTERMINAL-3.5MM-8 = drill 1.2 pad 2.032 square: 1 0,0 | drill 1.2 pad 2.032: 2 3.5,0; 3 7,0; 4 10.5,0; 5 14,0; 6 17.5,0; 7 21,0; 8 24.5,0
1X03 = drill 1.016 pad 1.88: 1 0,0; 2 2.54,0; 3 5.08,0
1X02 = drill 1.016 pad 1.88: 1 0,0; 2 2.54,0
1X04 = drill 1.016 pad 1.88 square: 1 0,0 | drill 1.016 pad 1.88: 2 2.54,0; 3 5.08,0; 4 7.62,0
LED-0603 = smd 1 x 1: A 0,-0.877; C 0,0.877
SOT23 = smd 1 x 1.4: 1 -0.95,-1.1; 2 0.95,-1.1; 3 0,1.1
0603-RES = smd 1.1 x 1: 1 -0.85,0; 2 0.85,0
R1210 = smd 1.6 x 2.7: 1 -1.4,0; 2 1.4,0
1206 = smd 1.6 x 1.8: 1 -1.4,0; 2 1.4,0
R2512 = smd 1.8 x 3.2: 1 -2.8,0; 2 2.8,0
PAD-JUMPER-3-2OF3_NC_BY_PASTE_YES_SILK_FULL_BOX = smd 0.635 x 1.27: 1 -0.813,0; 2 0,0; 3 0.813,0
PAD-JUMPER-2-NC_BY_PASTE_YES_SILK = smd 0.635 x 1.27: 1 -0.401,0; 2 0.413,0
STAND-OFF = hole 3.302: 0,0
DPAK = smd 1.6 x 3: 1 -2.28,-5.31; 3 2.28,-5.31 | smd 4.826 x 5.715: 4 0,1.588
SOT23-5 = smd 0.55 x 1.2: 1 -0.95,-1.3; 2 0,-1.3; 3 0.95,-1.3; 4 0.95,1.3; 5 -0.95,1.3
SOT-23-6 = smd 0.51 x 0.8: 1 -0.95,-1.3; 2 0,-1.3; 3 0.95,-1.3; 4 0.95,1.3; 5 0,1.3; 6 -0.95,1.3
TETHER-HEADER-2X7 = drill 1 pad 1.778: 5V 10.16,0; 12V 12.7,0; GND0 7.62,0; GND1 7.62,2.54; GND2 10.16,2.54; I_SENSE 15.24,2.54; NC0 0,2.54; NC1 2.54,2.54; NC2 5.08,2.54; RX 2.54,0; TX 5.08,0; V_SENSE 12.7,2.54; VBAT 15.24,0; VIDEO 0,0
TETHER-POWER-TERMINALS = drill 1.3 pad 2.184: 1A 0,0; 2A 5,0 | drill 2.2 pad 3.81: 1B -0.75,2.25; 2B 5.75,2.25
USB-MINIB = smd 2.5 x 0.5: D+ 2.5,0; D- 2.5,0.8; GND 2.5,-1.6; ID 2.5,-0.8; VBUS 2.5,1.6 | smd 2.5 x 2: GND@1 -3,-4.5; GND@2 -3,4.5; GND@3 2.5,4.5; GND@4 2.5,-4.5 | hole 0.9: 0,2.2; 0,-2.2

### Placement (x,y rotation side)
C1  10.79,6.99 0 top
C2  11.43,19.68 0 top
C3  108.9,25.72 270 top
C4  103.82,18.73 90 top
C5  15.24,17.14 90 top
C6  101.3,18.75 90 top
C7  10.79,12.06 0 top
C8  41.12,16.67 0 top
C9  96.84,13.97 180 top
C10  32.54,20.48 0 top
C11  72.07,34.29 270 top
C12  11.58,22.71 90 top
C13  31.43,31.43 180 top
C14  96.2,30.8 90 top
C15  92.39,17.46 0 top
C16  96.84,24.13 90 top
C17  108.9,18.73 270 top
C18  75.88,14.29 90 top
C19  83.5,14.29 90 top
C20  81.28,20 90 top
C21  67.63,34.29 90 top
C22  15.24,20.8 90 top
C23  78.11,25.4 0 top
C24  45.4,31.43 180 top
C25  41.59,26.67 180 top
D1  60.63,14.3 90 top
D2  45.4,29.21 180 top
F1  73.34,14.29 90 top
IC1  5.71,13.97 180 top
IC2  103.19,24.45 270 top
IC3  ST490AB  [SO08']  70.8,29.53 270 top
IC4  ST490AB  [SO08']  19.68,20.32 180 top
IC5  76.14,20.22 0 top
JP1  11.49,40.3 270 top
JP2  15.88,6.99 0 top
JP3  10.16,31.75 180 top
JP4  69.22,21.59 90 top
JP6  100.3,5.17 90 top
JP7  100.22,38.87 180 top
JP9  89.53,14.29 180 top
JP10  43.66,36.51 90 top
JP15  69.22,10.16 90 top
LED1  19.37,29.78 90 top
LED2  87.31,31.11 270 top
Q1  46.35,23.18 270 top
R1  10.79,9.53 0 top
R2  7.62,19.68 0 top
R3  7.62,22.86 180 top
R4  4.76,8.26 0 top
R5  10.79,4.45 0 top
R6  3.81,22.86 180 top
R7  7.62,25.72 180 top
R8  108.9,30.8 90 top
R9  106.36,30.8 270 top
R10  101.28,30.8 270 top
R11  98.74,30.8 270 top
R12  103.82,14.92 90 top
R13  106.36,14.92 270 top
R14  103.82,30.8 90 top
R15  78.06,33.75 180 top
R16  21.48,12.86 0 top
R17  69.85,34.29 270 top
R21  108.9,14.92 270 top
R22  106.36,18.73 270 top
R23  80.96,14.29 90 top
R24  78.42,14.29 90 top
R25  47.62,19.37 270 top
R26  78.11,30.48 0 top
R28  78.11,27.94 0 top
R29  17.78,13.02 270 top
R31  15.24,13.02 270 top
R32  42.55,23.18 90 top
R33  60.64,18.1 90 top
R34  53.98,28.89 270 top
R35  43.18,20 180 top
R36  40.01,34.29 0 top
R37  40.01,31.75 0 top
R38  15.56,30.8 0 top
R39  91.12,30.48 180 top
R44  41.59,29.21 180 top
R45  45.4,26.67 180 top
SJ1  40.48,37.78 270 top
SJ2  45.72,16.19 180 top
SJ4  67.69,37.82 0 top
STANDOFF1  3.17,3.17 0 top
STANDOFF2  60.33,3.17 0 top
STANDOFF3  60.33,42.55 0 top
STANDOFF4  3.17,42.55 0 top
STANDOFF5  67.31,3.17 0 top
STANDOFF6  109.22,3.17 0 top
STANDOFF7  67.31,42.55 0 top
STANDOFF8  109.22,42.55 0 top
U1  32.07,26.04 90 top
U2  90.17,22.54 270 top
U4  49.53,30.16 0 top
U5  32.07,14.92 90 top
U$1  11.43,15.88 270 top
U$2  96.84,17.46 90 top
U$3  52.07,19.37 0 top
U$4  63.34,37.94 270 bottom
U$5  105.41,39.21 270 top
U$6  59.05,24.45 0 top
U$7  LOGOFULL-M  [BR-FULL-LOGO-MEDIUM]  113.03,37.62 270 bottom
U$8  20.32,36.45 0 top
U$9  LOGOBR-LOGO-MS  [BR-LOGO-MEDIUM-SMALL]  57.31,33.18 270 top
U$10  48.26,8.27 0 top
U$11  53.98,37.24 180 top
U$12  86.04,8.37 0 top
X2  76.44,5.38 90 top

### Tracks (layer width: path | path; a pad name or v marks a point on that pad's centre or on a via)
3V3OUT
  Top 0.305: IC5.3 75.35,21.17 | 75.35,21.17 77.15,19.37 77.31,19.37 | 77.31,19.37 78.75,19.37 IC5.11 | IC5.10 78.05,18.63 77.31,19.37 | 75.35,21.17 75.35,23.49 C23.1
12V-ISO  (via drill 0.5)
  Top 0.61: U$8.12V 32.95,36.45 | v31.91,30 32.3,30 C13.P$1
  Top 1.016: U1.3 35.98,28.32 33.81,30.48 33.81,31.35 C13.P$1 33.73,35.73 U$8.12V
  Bottom 0.61: JP3.2 7.62,26.99 12.7,21.91 21.91,21.91 30,30 v31.91,30
-VCC
  Top 0.406: 103.82,17.65 C4.1 103.81,17.89 C6.1 100.64,17.24 | U$2.1 99.91,16.51 100.64,17.24 | IC2.4 100.57,20.94 100.05,20.42 100.05,17.83 100.64,17.24
-VCC-ISO  (via drill 0.5)
  Top 0.406: 10.79,20.95 11.43,21.59 11.58,21.59 C12.1 | 10.79,20.95 10.48,20.64 10.48,19.79 C2.1 10.48,19.58 10.48,18.73 10.13,18.39 U$1.1 | IC1.4 3.81,18.41 v4.13,18.73 | v9.53,21.27 10.48,21.27 10.79,20.95
  Bottom 0.406: v4.13,18.73 6.99,18.73 v9.53,21.27
CAMERA
  Top 0.305: IC1.3 5.08,22.44 R6.1 4.66,23.61 R7.2
  Top 0.61: R7.2 5.08,27.41 JP3.3 5.08,32.38 6.51,33.81 12.41,33.81 JP1.PIN 20.17,36.59 U$8.VIDEO
GND  (via drill 0.5)
  Top 0.305: IC5.5 74.71,19.9 v75.25,19.37 | IC5.13 80.97,20.54 C20.2
  other vias: 80.49,25.08 81.92,22.86 75.25,16.67 102.59,21.34 99.21,21.36
  pour Top (isolate 0.305): 64.45,45.72 114.94,45.72 114.94,-2.54 64.45,-2.54
  pour Bottom (isolate 0.305): 64.45,48.26 112.39,48.26 112.39,0 64.45,0
GND-ISO  (via drill 0.5)
  Top 0.406: U4.2 49.53,33.02 49.21,33.34
  other vias: 13.34,12.06 7.3,13.97 13.34,6.99 43.18,33.02 45.72,20 35.56,30.96 27.2,31.41 28.73,18.76
  pour Top (isolate 0.305): -2.54,-2.54 -2.54,48.26 19.53,48.26 19.53,-2.54
  pour Bottom (isolate 0.305): 0,45.72 63.18,45.72 63.18,-5.08 0,-5.08
  pour Top (isolate 0.254): 20.32,48.26 49.85,48.26 49.85,33.5 52.07,31.27 52.07,27.94 46.51,27.94 46.51,25.08 48.26,23.34 48.26,12.22 49.85,10.64 49.85,-2.54 20.32,-2.54
I_SENSE  (via drill 0.5)
  Top 0.406: R45.2 44.25,26.97 D2.A 44.25,29.41 v42.55,31.11
  Bottom 0.406: v42.55,31.11 39.37,31.11 39.37,31.27 36.83,33.81 36.83,35.4 37.15,35.72 37.15,37.4 U$8.I_SENSE
N$1  (via drill 0.5)
  Top 0.305: R2.2 8.47,18.52 v8.89,18.1 | v8.57,9.53 R1.1
  Top 0.406: IC1.1 7.62,16.83 v8.89,18.1
  Bottom 0.305: v8.89,18.1 8.89,9.84 v8.57,9.53
N$2
  Top 0.305: R5.1 9.21,4.45 6.67,6.99 5.4,8.15 R4.2 5.61,8.79 6.35,9.53 IC1.7 6.57,11.14
N$3
  Top 0.406: U$2.5 96.2,17.46 97,16.67 97,15.24 97.63,14.61 97.63,14.03 C9.1
N$4
  Top 0.406: C9.2 95.99,16.06 U$2.6
N$5
  Top 0.305: IC1.2 6.35,19.27 R2.1 R3.2
N$6
  Top 0.305: 4.87,11.14 IC1.6 5.08,9.84 4.03,8.79 4.03,8.37 R4.1 3.49,8.26 2.96,8.79 R6.2
N$7
  Top 0.406: C11.1 72.07,36.35 70.48,37.94 68.22,37.94 SJ4.2
N$8
  Top 0.406: R11.2 R10.2 101.28,28.57 103.03,26.83 103.03,23.97 104.46,22.54 IC2.5
N$9
  Top 0.406: R8.1 R9.2 106.36,28.89 105.41,27.94 104.78,27.94 103.82,26.99 103.82,24.45 104.46,23.81 IC2.6
N$10
  Top 0.305: U$1.5 14.98,15.88 C5.1
N$11
  Top 0.305: U$1.6 13.49,16.82 14.29,17.62 15.03,17.62 C5.2
N$14  (via drill 0.5)
  Top 0.406: R8.2 v108.9,33.34 | IC2.7 107,25.08 107.63,24.45 107.63,24.13 108.58,23.18 v108.58,22.86 108.9,22.54 C17.1 R22.1
  Bottom 0.406: v108.9,33.34 108.9,23.18 v108.58,22.86
N$15
  Top 0.406: R21.2 108.69,14.29 108.27,14.29 106.78,15.77 R13.1 R22.2 106.26,17.78 105.73,17.78 105.09,18.41 105.09,20.64 102.23,23.5 102.23,24.77 101.92,25.08 IC2.2
N$16
  Top 0.406: R21.1 C17.2
N$17  (via drill 0.5)
  Top 0.406: R12.1 105.09,14.07 | 105.09,14.07 R13.2 | IC2.1 100.57,27.06 v99.69,27.94 | v105.09,12.38 105.09,14.07
  Bottom 0.406: v99.69,27.94 103.5,27.94 105.09,26.35 v105.09,12.38
N$19  (via drill 0.5)
  Top 0.406: X2.D- 75.64,10.4 v75.09,10.95 | v81.12,10.95 81.12,13.28 R23.1 C19.1
  Bottom 0.406: v75.09,10.95 v81.12,10.95
N$20
  Top 0.406: X2.D+ 76.44,11.5 75.88,12.06 75.88,12.7 | 75.88,12.7 C18.1 | R24.1 76.62,13.44 75.88,12.7
N$21
  Top 0.406: F1.1 73.34,10.95 74.77,9.53 74.77,7.96 X2.VBUS
N$22
  Top 0.305: R24.2 78.42,15.56 76.04,17.94 73.48,17.94 IC5.8
N$23
  Top 0.406: 76.94,27.62 R28.1 76.39,27.62 IC3.5
N$24
  Top 0.406: IC4.5 17.78,16.96 R31.1
N$25
  Top 0.406: IC4.6 19.05,15.69 R29.1
N$26
  Top 0.406: IC3.6 75.12,28.89 R26.1
N$27
  Top 0.406: Q1.1 42.65,24.13 R32.2
N$28  (via drill 0.5)
  Top 0.305: U$6.4 60.96,20.95 62.23,19.68 62.23,17.78 61.59,17.14 60.74,17.14 R33.1 60.64,16.19 | 60.64,16.19 60.64,15.47 D1.A | U$3.4 53.98,18.73 v53.66,19.05 48.16,19.05 R25.2 | v61.91,16.19 60.64,16.19
  Bottom 0.305: v53.66,19.05 59.05,19.05 v61.91,16.19
N$29
  Top 0.305: R23.2 80.96,15.89 IC5.9
N$30
  Top 0.406: Q1.3 47.45,20.39 R25.1
N$31
  Top 0.406: R38.2 17.22,30.8 LED1.C
N$32
  Top 0.406: LED2.C 89.64,31.11 R39.2
N$33
  Top 0.406: R44.1 C25.1 42.44,26.14 43.18,25.4 45.72,25.4 46.35,26.04 46.35,26.57 R45.1 46.39,26.67 U4.1
ROV-ALT-VIN
  Top 0.61: SJ1.1 41.57,38.59 JP10.1
ROV-BATT
  Top 0.406: SJ2.1 49.61,16.19 U$3.1
  pour Top (isolate 0.305, no thermals): 50.8,-2.54 63.18,-2.54 63.18,23.18 58.42,23.18 54.61,19.37 49.21,19.37 49.21,12.7 50.8,11.11
ROV-ON  (via drill 0.5)
  Top 0.406: v41.91,12.06 44.77,14.92 44.77,16.05 SJ2.3
  Bottom 0.406: JP2.7 36.88,7.03 v41.91,12.06
ROV-ON-CTRL
  Top 0.406: R17.1 70.21,35.14 C11.2 73.13,33.44 77.47,37.78 78.14,37.78 JP7.7
ROV-ON-SELECT
  Top 0.406: R32.1 42.55,20.22 R35.2 42.33,18.95 43.18,18.1 44.77,18.1 45.72,17.14 SJ2.2
ROV-RX  (via drill 0.5)
  Top 0.406: IC4.2 20.32,26.8 22.48,28.96 22.48,32.54 v22.94,32.99
  Bottom 0.406: v22.94,32.99 22.94,36.37 U$8.RX
ROV-TP1+
  Top 0.406: JP2.1 15.88,7.94 14.29,9.53 R1.2
ROV-TP1-
  Top 0.406: R5.2 16.84,4.45 JP2.2
ROV-TP2+
  Top 0.406: JP2.3 22.88,7.29 21.27,8.89 16.83,8.89 15.24,10.48 R31.2
ROV-TP2-
  Top 0.406: JP2.4 26.35,6.99 23.5,9.84 18.41,9.84 17.78,10.48 R29.2
ROV-TP3+  (via drill 0.5)
  Top 0.406: IC4.8 21.59,14.15 R16.2 24.45,12.86 v24.92,12.38
  Bottom 0.406: JP2.5 29.88,7.43 v24.92,12.38
ROV-TP3-
  Top 0.406: JP2.6 33.34,6.99 31.43,8.89 26.04,8.89 24.13,10.79 20.64,10.79 20,11.43 20,12.79 R16.1 20.27,12.67 20.32,12.67 IC4.7
ROV-TX
  Top 0.406: IC4.3 19.05,26.67 21.64,29.26 21.64,33.68 22.63,34.67 23.62,34.67 U$8.TX
ROV-VIN  (via drill 0.7)
  Top 0.61: SJ1.2 36.9,37.78 U$8.VBAT
  Top 1.016: U1.1 37.48,23.65 v40.01,23.65 40.01,16.93 C8.1 40.01,16.41 v40.01,12.7 37.44,12.7 U5.1
  Bottom 1.016: U$8.VBAT 35.56,32.86 38.26,30.16 38.26,25.4 v40.01,23.65
ROV-VIN-PRESENSE
  Top 0.406: U4.3 51.2,28.86 R34.2
  pour Top (no thermals): 49.21,20.32 49.21,23.81 47.62,25.4 47.62,26.99 53.02,26.99 53.02,28.89 63.18,28.89 63.18,24.13 57.78,24.13 53.98,20.32
ROV-VIN-SWITCHED
  Top 0.406: U4.4 53.74,31.46 R34.1 | 52.23,40.64 52.39,40.48 52.39,38.19 U$11.1A
  Top 0.61: 40.85,36.6 SJ1.3
  Top 0.813: 52.23,40.64 46.35,40.64 45.56,39.85 45.56,35.72 44.13,34.29 R36.2 40.85,36.6
  pour Top (no thermals): 63.18,29.84 63.18,48.26 50.8,48.26 50.8,33.97 52.39,32.38 53.02,31.75 53.02,29.84
RTS  (via drill 0.5)
  Top 0.305: IC5.2 74.51,21.81 74.77,22.07 74.77,24.45 v75.25,24.92 | v67.31,36.35 67.31,37.91
  Top 0.406: SJ4.1 67.29,37.9 67.31,37.91
  Bottom 0.305: v75.25,24.92 75.25,26.83 71.75,30.32 69.53,30.32 67.31,32.54 v67.31,36.35
RX-I  (via drill 0.5)
  Top 0.305: v70.8,20 71.6,20 72.07,20.48 73.36,20.48 IC5.4
  Top 0.406: IC3.2 70.17,30.16 v71.12,29.21
  Bottom 0.406: v71.12,29.21 71.12,20.32 v70.8,20 68.74,20 67.31,18.57 67.31,14.61 JP15.2
TOP-TP1+
  Top 0.406: JP7.1 100.22,36.94 103.82,33.34 R14.2 R9.1
TOP-TP1-
  Top 0.406: JP7.2 96.72,37.9 101.28,33.34 R10.1 101.7,31.65 102.55,30.8 102.55,30.16 102.87,29.84 103.72,29.84 R14.1
TOP-TP2+
  Top 0.406: JP7.3 90.87,36.51 77.63,36.51 76.68,35.56 76.68,33.77 R15.2 | R15.2 76.75,33.75 77,34 76.69,34 76.34,33.66 | IC3.8 73.88,32.44 75.09,33.66 76.56,33.66 R15.2
TOP-TP2-  (via drill 0.5)
  Top 0.406: v89.69,35.08 89.53,35.24 85.41,35.24 83.98,33.81 83.73,33.75 R15.1 79.68,33.97 79.85,33.97 77.79,31.91 75.72,31.91 75.41,31.59 75.41,30.64 74.93,30.16 IC3.7
  Bottom 0.406: v89.69,35.08 89.69,38.84 JP7.4
TOP-TP3+  (via drill 0.5)
  Top 0.406: R28.2 80.64,27.94 v81.92,29.21
  Bottom 0.406: JP7.5 81.92,34.56 81.92,34.29 v81.92,29.21
TOP-TP3-  (via drill 0.5)
  Top 0.406: R26.2 79.5,30.77 v80.8,31.75
  Bottom 0.406: JP7.6 80.8,36.95 v80.8,31.75
TOP-VIN
  Top 0.406: C15.1 90.49,17.46 89.07,16.05
  Top 0.813: 89.53,15.4 89.53,15.59 89.07,16.05 | 91.76,10.65 U$12.2B
  Top 1.016: 91.76,10.65 91.76,12.06 JP9.1 89.53,15.4 87.63,17.3 87.63,22.38 85.19,24.82 U2.1 | U$12.2B 91.79,9.12 U$12.2A
TX-O  (via drill 0.5)
  Top 0.406: IC5.1 73.42,24.85 70.64,27.62 | 70.64,27.62 69.37,28.89 IC3.3 | v67.15,26.04 69.06,26.04 70.64,27.62
  Bottom 0.406: JP15.1 68.58,10.16 66.52,12.22 66.52,25.4 v67.15,26.04
V_SENSE  (via drill 0.5)
  Top 0.406: v37.94,34.77 38.42,34.29 R36.1 39.16,33.87 40.01,33.02 40.32,33.02 40.96,32.38 40.96,31.85 R37.2
  Bottom 0.406: v37.94,34.77 37.94,39.37 36.67,40.64 34.67,40.64 U$8.V_SENSE
VCC  (via drill 0.5)
  Top 0.305: IC5.12 79.95,19.9 80.64,19.21 81.22,19.21 C20.1 | U$2.3 98.14,19.81 v97.63,20.32
  Top 0.406: C3.1 107.63,26.57 | 107.63,26.57 106.02,26.57 IC2.8 | U$2.3 U$2.4 | C16.A 96.84,27.78 v96.68,27.94 96.2,28.42 C14.1 | v107.31,27.94 107.31,26.89 107.63,26.57 | JP4.1 69.22,20.16 70.96,18.41 70.96,15.56 71.28,15.24 | R17.2 C21.1 67.73,33.22 IC3.1 71.28,31.43 v71.12,31.59 | v83.52,27.58 83.52,28.2 LED2.A
  Top 0.61: JP15.3 71.28,15.24 72.89,15.24 F1.2 | C20.1 82.49,17.94 v83.19,17.94 84.86,19.61 U2.3
  Bottom 0.305: v97.63,20.32 97.63,26.99 v96.68,27.94
  Bottom 0.406: v96.68,27.94 97.47,27.94 98.58,29.05 106.2,29.05 v107.31,27.94 | 83.34,26.19 83.34,27.41 v83.52,27.58
  Bottom 0.61: 83.34,26.19 94.93,26.19 v96.68,27.94 | JP15.3 80.49,15.24 v83.19,17.94 83.34,18.1 83.34,26.19 | 83.34,26.19 80.33,26.19 74.93,31.59 v71.12,31.59
VCC-ISO  (via drill 0.5, 0.7)
  Top 0.305: 9.95,14.74 U$1.3 | 15.14,19.84 C22.1
  Top 0.406: C1.1 8.57,6.99 7.62,7.94 IC1.8 8.33,12.06 C7.1 9.95,14.74 | U$1.3 11.43,14.93 | 11.43,14.93 U$1.4 | 11.43,14.93 11.43,17.46 12.06,18.1 13.02,18.1 13.65,18.73 13.65,19.53 13.97,19.84 15.14,19.84 | D2.C 46.55,31.13 C24.1 | C24.1 48.55,31.43 U4.5 | C24.1 46.25,32.33 45.56,33.02 v44.93,33.02 | C22.1 17.57,19.95 v17.62,20 18.26,20.64 20.8,20.64 21.59,21.43 IC4.1 | LED1.A 20.24,29.46 18.67,27.89 v17.75,27.89
  Top 0.61: U5.3 36.14,17.2 | 33.97,20.45 C10.A
  Top 1.016: v36.2,21.11 34.58,21.11 C10.A | 36.14,17.2 33.97,19.37 33.97,20.45
  Bottom 0.406: v44.93,33.02 44.93,31.59 43.18,29.84 43.18,23.65 40.8,21.27 36.35,21.27 v36.2,21.11 35.08,20 v17.62,20 | v17.75,27.89 26.21,27.89 31.23,32.91
  Bottom 1.016: U$8.5V 30.48,33.66 31.23,32.91 36.2,27.94 v36.2,21.11
VIDEO-OUT
  Top 0.406: R12.2 103.72,15.88 103.19,15.88 102.55,15.24 102.55,12.38 99.06,8.89 96.62,8.89 JP6.PIN

### Text on the board
Reference: <-- VSCORE
tDocu: NC | NC | NC | GND | GND | V / SENSE | I / SENSE | ALT / ROV / PWR | ALT / - | - | + | 4- / BRN | 4+ / WHT | 3- / GRN | 3+ / WHT | 2- / ORN | 2+ / WHT | 1- / BLU | 1+ / WHT | PAIR#: / COLOR: | ROV PWR | VIDEO | RX | TX | GND | 5V | 12V | ROV / PWR | ALT / + | BATT / ROV / PWR | RTS / RESET | RCA / CAMERA | SWITCHED / BATT PWR | PWR | CAMERA | PWR | VID | *12V | GND | 5V OUT | GND | +5V | GND | BATT | - | + | +5V | TETHER / PWR-SW | ALWAYS / ON | RX | VIDEO OUT | 7-26V IN | TX | FATHOM-ROV-INTERFACE rev2 | FATHOM-TOPSIDE-INTERFACE rev2 | BATT | BATT (7-26V) | PAIR#: / COLOR: | 1+ / WHT | 1- / BLU | 2+ / WHT | 2- / ORN | 3+ / WHT | 3- / GRN | 4+ / WHT | 4- / BRN | - | + | - | +
bDocu: 10/15 | 10/15 | *Only if VBAT>13V